# Altium project NB3000XN.PRJPCB (part 2 of 3)

## Sheet FPGA_NonIO.SchDoc: USER FPGA Pwr and Programming
size A4; Organization: Altium Limited.; Address1: Level 3, 12a Rodborough Rd; Address2: Frenchs Forest 2086; Address3: NSW; Address4: AUSTRALIA; DocumentNumber: 8; SheetNumber: 9; SheetTotal: 78
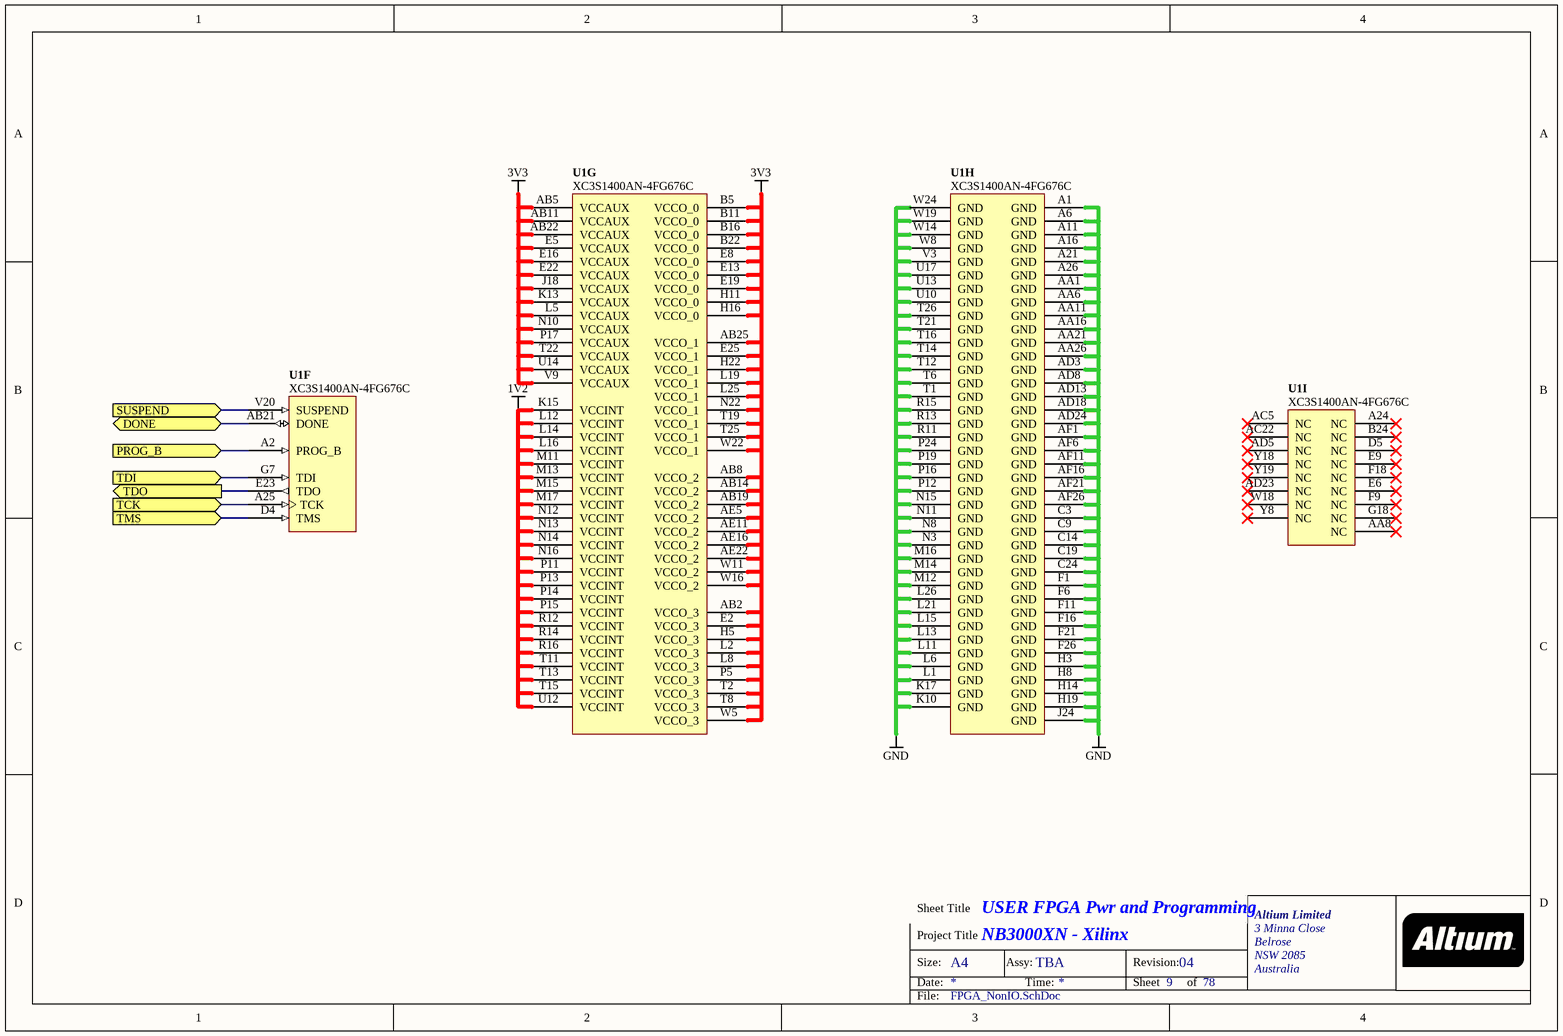
[diagram p4: FPGA_NonIO.SchDoc]

### Parts
(Parts that share a designator on the sheet are numbered #1, #2 ... from top to bottom, then left to right.)
U1#1  XC3S1400AN-4FG676C  [BGA100P26X26-676]  (parts F,G,H,I of 9)

### Ports
DONE (bidir), PROG_B (in), SUSPEND (in), TCK (in), TDI (in), TDO (out), TMS (in)

### Nets
1V2: U1#1.K15(VCCINT) U1#1.L12(VCCINT) U1#1.L14(VCCINT) U1#1.L16(VCCINT) U1#1.M11(VCCINT) U1#1.M13(VCCINT) U1#1.M15(VCCINT) U1#1.M17(VCCINT) U1#1.N12(VCCINT) U1#1.N13(VCCINT) U1#1.N14(VCCINT) U1#1.N16(VCCINT) U1#1.P11(VCCINT) U1#1.P13(VCCINT) U1#1.P14(VCCINT) U1#1.P15(VCCINT) U1#1.R12(VCCINT) U1#1.R14(VCCINT) U1#1.R16(VCCINT) U1#1.T11(VCCINT) U1#1.T13(VCCINT) U1#1.T15(VCCINT) U1#1.U12(VCCINT)
3V3: U1#1.AB2(VCCO_3) U1#1.AB5(VCCAUX) U1#1.AB8(VCCO_2) U1#1.AB11(VCCAUX) U1#1.AB14(VCCO_2) U1#1.AB19(VCCO_2) U1#1.AB22(VCCAUX) U1#1.AB25(VCCO_1) U1#1.AE5(VCCO_2) U1#1.AE11(VCCO_2) U1#1.AE16(VCCO_2) U1#1.AE22(VCCO_2) U1#1.B5(VCCO_0) U1#1.B11(VCCO_0) U1#1.B16(VCCO_0) U1#1.B22(VCCO_0) U1#1.E2(VCCO_3) U1#1.E5(VCCAUX) U1#1.E8(VCCO_0) U1#1.E13(VCCO_0) U1#1.E16(VCCAUX) U1#1.E19(VCCO_0) U1#1.E22(VCCAUX) U1#1.E25(VCCO_1) U1#1.H5(VCCO_3) U1#1.H11(VCCO_0) U1#1.H16(VCCO_0) U1#1.H22(VCCO_1) U1#1.J18(VCCAUX) U1#1.K13(VCCAUX) U1#1.L2(VCCO_3) U1#1.L5(VCCAUX) U1#1.L8(VCCO_3) U1#1.L19(VCCO_1) U1#1.L25(VCCO_1) U1#1.N10(VCCAUX) U1#1.N22(VCCO_1) U1#1.P5(VCCO_3) U1#1.P17(VCCAUX) U1#1.T2(VCCO_3) U1#1.T8(VCCO_3) U1#1.T19(VCCO_1) U1#1.T22(VCCAUX) U1#1.T25(VCCO_1) U1#1.U14(VCCAUX) U1#1.V9(VCCAUX) U1#1.W5(VCCO_3) U1#1.W11(VCCO_2) U1#1.W16(VCCO_2) U1#1.W22(VCCO_1)
GND: U1#1.A1(GND) U1#1.A6(GND) U1#1.A11(GND) U1#1.A16(GND) U1#1.A21(GND) U1#1.A26(GND) U1#1.AA1(GND) U1#1.AA6(GND) U1#1.AA11(GND) U1#1.AA16(GND) U1#1.AA21(GND) U1#1.AA26(GND) U1#1.AD3(GND) U1#1.AD8(GND) U1#1.AD13(GND) U1#1.AD18(GND) U1#1.AD24(GND) U1#1.AF1(GND) U1#1.AF6(GND) U1#1.AF11(GND) U1#1.AF16(GND) U1#1.AF21(GND) U1#1.AF26(GND) U1#1.C3(GND) U1#1.C9(GND) U1#1.C14(GND) U1#1.C19(GND) U1#1.C24(GND) U1#1.F1(GND) U1#1.F6(GND) U1#1.F11(GND) U1#1.F16(GND) U1#1.F21(GND) U1#1.F26(GND) U1#1.H3(GND) U1#1.H8(GND) U1#1.H14(GND) U1#1.H19(GND) U1#1.J24(GND) U1#1.K10(GND) U1#1.K17(GND) U1#1.L1(GND) U1#1.L6(GND) U1#1.L11(GND) U1#1.L13(GND) U1#1.L15(GND) U1#1.L21(GND) U1#1.L26(GND) U1#1.M12(GND) U1#1.M14(GND) U1#1.M16(GND) U1#1.N3(GND) U1#1.N8(GND) U1#1.N11(GND) U1#1.N15(GND) U1#1.P12(GND) U1#1.P16(GND) U1#1.P19(GND) U1#1.P24(GND) U1#1.R11(GND) U1#1.R13(GND) U1#1.R15(GND) U1#1.T1(GND) U1#1.T6(GND) U1#1.T12(GND) U1#1.T14(GND) U1#1.T16(GND) U1#1.T21(GND) U1#1.T26(GND) U1#1.U10(GND) U1#1.U13(GND) U1#1.U17(GND) U1#1.V3(GND) U1#1.V20(SUSPEND) U1#1.W8(GND) U1#1.W14(GND) U1#1.W19(GND) U1#1.W24(GND) ; port SUSPEND
DONE: U1#1.AB21(DONE) ; port DONE
PROG_B: U1#1.A2(PROG_B) ; port PROG_B
TCK: U1#1.A25(TCK) ; port TCK
TDI: U1#1.G7(TDI) ; port TDI
TDO: U1#1.E23(TDO) ; port TDO
TMS: U1#1.D4(TMS) ; port TMS

Not connected (* = marked no-connect by the designer): U1#1 A24(NC)* AA8(NC)* AC5(NC)* AC22(NC)* AD5(NC)* AD23(NC)* B24(NC)* D5(NC)* E6(NC)* E9(NC)* F9(NC)* F18(NC)* G18(NC)* W18(NC)* Y8(NC)* Y18(NC)* Y19(NC)*

### Notes on the sheet
- Sheet Title
- Project Title
- Size:
- Date:
- A4
- Assy:
- Time:
- Revision:
- Sheet
- of
- File:

### Library data of the parts
U1#1 = D-241-0015: FPGA, Xilinx Spartan 3AN-1400 FG676; Supply Voltage: mV; Mounting Technology: Surface Mount; Status: Unreleased; Technology: None; Category: IC-FPGA; NexusDeviceId: XC3S1400AN-4FG676C

## Sheet FPGA_Bypass_1V2.SCHDOC: FPGA Bypass 1V2
size A4; Organization: Altium Limited.; Address1: Level 3, 12a Rodborough Rd; Address2: Frenchs Forest 2086; Address3: NSW; Address4: AUSTRALIA; DocumentNumber: 60; SheetNumber: 61; SheetTotal: 78; PageSetup: Record=PageOptions|CenterHorizontal=True|CenterVertical=True|PrintScale=0.97|XCorrection=1.00|YCorrection=1.00|PrintKind=0|BorderSize=5000000|LeftOffset=0|BottomOffset=0|Orientation=2|PaperLength=1000|PaperWidth=1000|Scale=100|PaperSource=7|PrintQuality=-4|MediaType=1|DitherType=10|PaperKind=A4 (210 x 297 mm)|PrintScaleMode=1
Used 2 times, as channels FPGA_USER/USER_DECOUPLING_CAPS_1V2, FPGA_HOST/HOST_DECOUPLING_CAPS_1V2. Parts and nets are listed once, with the designators drawn on the sheet.
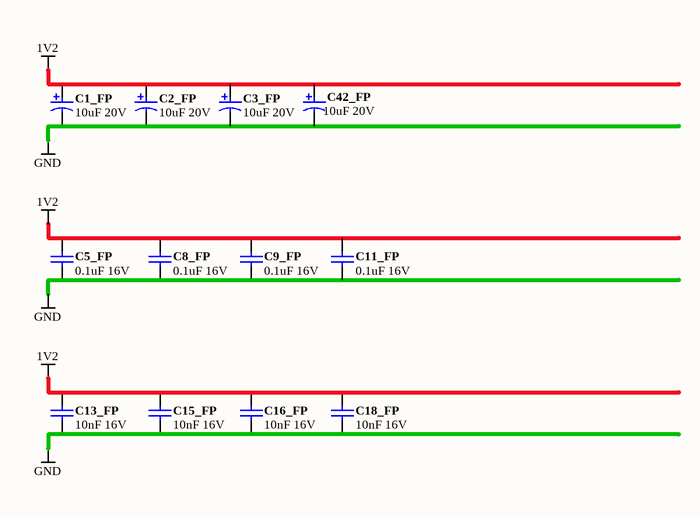
[diagram p5: FPGA_Bypass_1V2.SCHDOC]

### Parts
C1_FP  10uF 20V  [CAPC3528-STAR]
C2_FP  10uF 20V  [CAPC3528-STAR]
C3_FP  10uF 20V  [CAPC3528-STAR]
C5_FP  0.1uF 16V  [CAPC1005-STAR]
C8_FP  0.1uF 16V  [CAPC1005-STAR]
C9_FP  0.1uF 16V  [CAPC1005-STAR]
C11_FP  0.1uF 16V  [CAPC1005-STAR]
C13_FP  10nF 16V  [CAPC1005-STAR]
C15_FP  10nF 16V  [CAPC1005-STAR]
C16_FP  10nF 16V  [CAPC1005-STAR]
C18_FP  10nF 16V  [CAPC1005-STAR]
C42_FP  10uF 20V  [CAPC3528-STAR]

### Nets
1V2: C1_FP.1 C2_FP.1 C3_FP.1 C5_FP.1 C8_FP.1 C9_FP.1 C11_FP.1 C13_FP.1 C15_FP.1 C16_FP.1 C18_FP.1 C42_FP.1
GND: C1_FP.2 C2_FP.2 C3_FP.2 C5_FP.2 C8_FP.2 C9_FP.2 C11_FP.2 C13_FP.2 C15_FP.2 C16_FP.2 C18_FP.2 C42_FP.2

### Channels
FPGA_USER/USER_DECOUPLING_CAPS_1V2: designators end in A
FPGA_HOST/HOST_DECOUPLING_CAPS_1V2: designators end in B

### Notes on the sheet
- Sheet Title
- Project Title
- Size:
- Date:
- A4
- Assy:
- Time:
- Revision:
- Sheet
- of
- File:

### Library data of the parts
C1_FP C2_FP C3_FP C42_FP = D-101-0007: Capacitor, Tantalum, 10uF 10% 20V MCCT-B (3528); Polarity: Polarized; Category: Capacitor; Capacitance: 10 uF; Mounting Technology: Surface Mount; Rated Voltage: 20 V; Status: Production; Technology: Tantalum; Tolerance: 10 %
C5_FP C8_FP C9_FP C11_FP = D-101-0080: Capacitor, Ceramic, 0.1uF 10% 16V 0402 (1005) X7R; Polarity: Non-Polarized; Category: Capacitor; Capacitance: 0.1 uF; Dielectric: X7R; Mounting Technology: Surface Mount; Rated Voltage: 16 V; Status: Production; Technology: Ceramic; Tolerance: 10 %
C13_FP C15_FP C16_FP C18_FP = D-101-0077: Capacitor, Ceramic, 10nF 10% 16V 0402 (1005) X7R; Polarity: Non-Polarized; Category: Capacitor; Capacitance: 10 nF; Dielectric: X7R; Mounting Technology: Surface Mount; Rated Voltage: 16 V; Status: Production; Technology: Ceramic; Tolerance: 10 %

## Sheet FPGA_Bypass_3V3.SCHDOC: FPGA Bypass 3V3
size A4; Organization: Altium Limited.; Address1: Level 3, 12a Rodborough Rd; Address2: Frenchs Forest 2086; Address3: NSW; Address4: AUSTRALIA; DocumentNumber: 58; SheetNumber: 59; SheetTotal: 78; PageSetup: Record=PageOptions|CenterHorizontal=True|CenterVertical=True|PrintScale=0.97|XCorrection=1.00|YCorrection=1.00|PrintKind=0|BorderSize=5000000|LeftOffset=0|BottomOffset=0|Orientation=2|PaperLength=1000|PaperWidth=1000|Scale=100|PaperSource=7|PrintQuality=-4|MediaType=1|DitherType=10|PaperKind=A4 (210 x 297 mm)|PrintScaleMode=1
Used 2 times, as channels FPGA_USER/USER_DECOUPLING_CAPS_3V3, FPGA_HOST/HOST_DECOUPLING_CAPS_3V3. Parts and nets are listed once, with the designators drawn on the sheet.
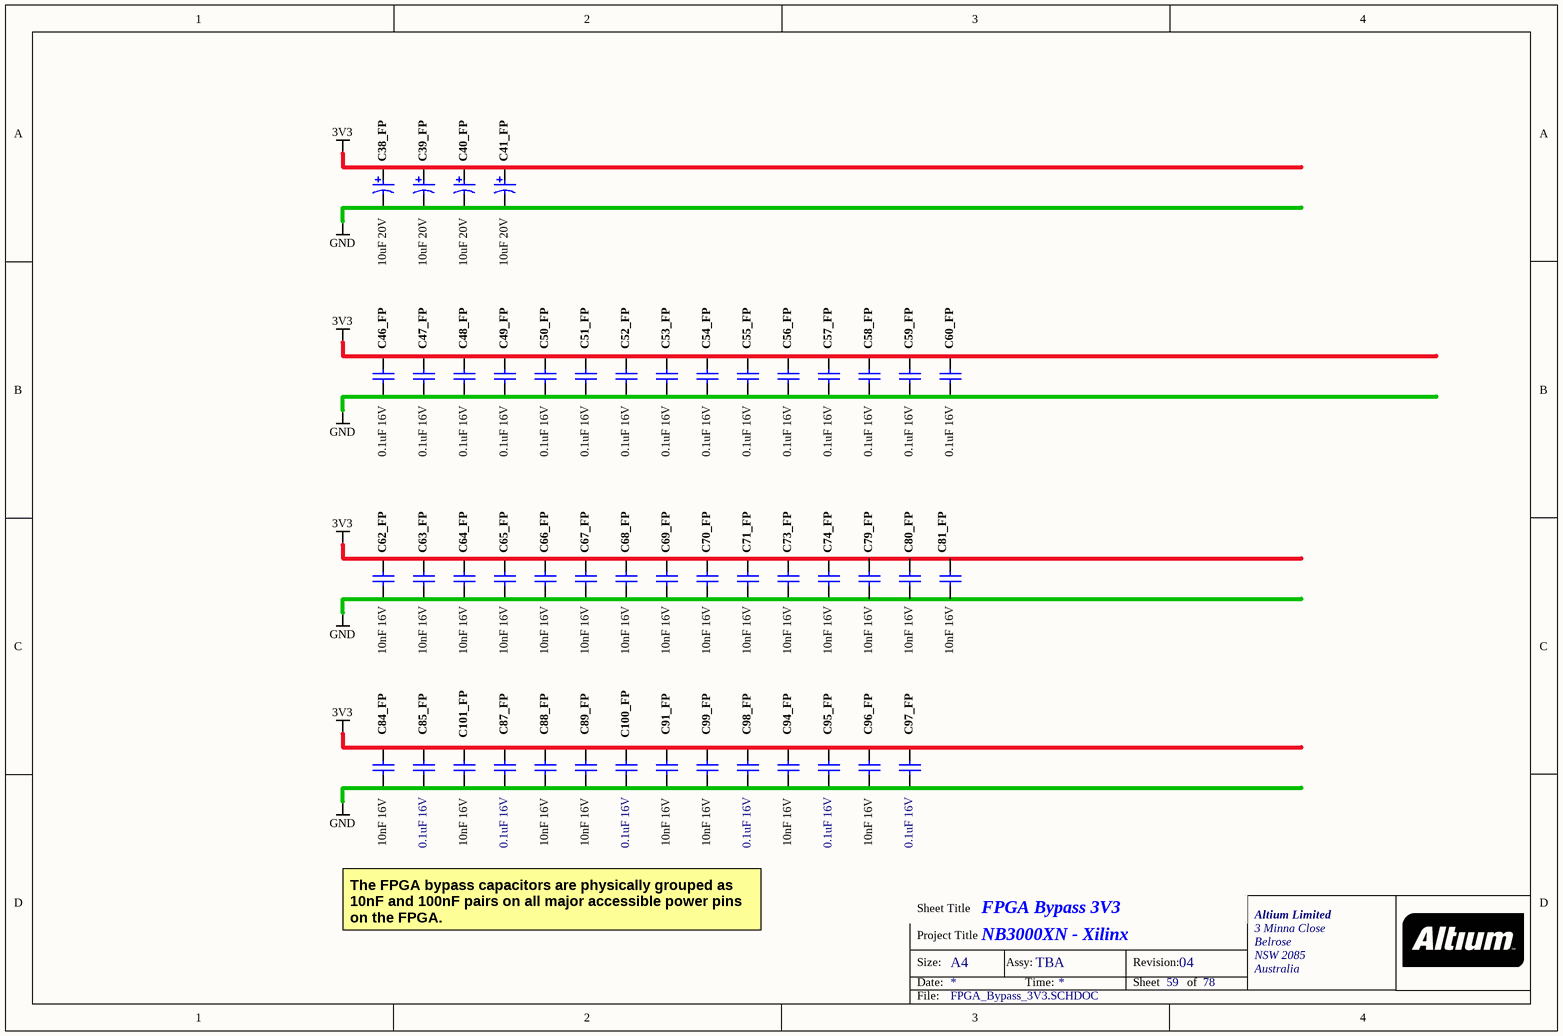
[diagram p6: FPGA_Bypass_3V3.SCHDOC]

### Parts
C38_FP  10uF 20V  [CAPC3528-STAR]
C39_FP  10uF 20V  [CAPC3528-STAR]
C40_FP  10uF 20V  [CAPC3528-STAR]
C41_FP  10uF 20V  [CAPC3528-STAR]
C46_FP  0.1uF 16V  [CAPC1005-STAR]
C47_FP  0.1uF 16V  [CAPC1005-STAR]
C48_FP  0.1uF 16V  [CAPC1005-STAR]
C49_FP  0.1uF 16V  [CAPC1005-STAR]
C50_FP  0.1uF 16V  [CAPC1005-STAR]
C51_FP  0.1uF 16V  [CAPC1005-STAR]
C52_FP  0.1uF 16V  [CAPC1005-STAR]
C53_FP  0.1uF 16V  [CAPC1005-STAR]
C54_FP  0.1uF 16V  [CAPC1005-STAR]
C55_FP  0.1uF 16V  [CAPC1005-STAR]
C56_FP  0.1uF 16V  [CAPC1005-STAR]
C57_FP  0.1uF 16V  [CAPC1005-STAR]
C58_FP  0.1uF 16V  [CAPC1005-STAR]
C59_FP  0.1uF 16V  [CAPC1005-STAR]
C60_FP  0.1uF 16V  [CAPC1005-STAR]
C62_FP  10nF 16V  [CAPC1005-STAR]
C63_FP  10nF 16V  [CAPC1005-STAR]
C64_FP  10nF 16V  [CAPC1005-STAR]
C65_FP  10nF 16V  [CAPC1005-STAR]
C66_FP  10nF 16V  [CAPC1005-STAR]
C67_FP  10nF 16V  [CAPC1005-STAR]
C68_FP  10nF 16V  [CAPC1005-STAR]
C69_FP  10nF 16V  [CAPC1005-STAR]
C70_FP  10nF 16V  [CAPC1005-STAR]
C71_FP  10nF 16V  [CAPC1005-STAR]
C73_FP  10nF 16V  [CAPC1005-STAR]
C74_FP  10nF 16V  [CAPC1005-STAR]
C79_FP  10nF 16V  [CAPC1005-STAR]
C80_FP  10nF 16V  [CAPC1005-STAR]
C81_FP  10nF 16V  [CAPC1005-STAR]
C84_FP  10nF 16V  [CAPC1005-STAR]
C85_FP  0.1uF 16V  [CAPC1005-STAR]
C87_FP  0.1uF 16V  [CAPC1005-STAR]
C88_FP  10nF 16V  [CAPC1005-STAR]
C89_FP  10nF 16V  [CAPC1005-STAR]
C91_FP  10nF 16V  [CAPC1005-STAR]
C94_FP  10nF 16V  [CAPC1005-STAR]
C95_FP  0.1uF 16V  [CAPC1005-STAR]
C96_FP  10nF 16V  [CAPC1005-STAR]
C97_FP  0.1uF 16V  [CAPC1005-STAR]
C98_FP  0.1uF 16V  [CAPC1005-STAR]
C99_FP  10nF 16V  [CAPC1005-STAR]
C100_FP  0.1uF 16V  [CAPC1005-STAR]
C101_FP  10nF 16V  [CAPC1005-STAR]

### Nets
3V3: C38_FP.1 C39_FP.1 C40_FP.1 C41_FP.1 C46_FP.1 C47_FP.1 C48_FP.1 C49_FP.1 C50_FP.1 C51_FP.1 C52_FP.1 C53_FP.1 C54_FP.1 C55_FP.1 C56_FP.1 C57_FP.1 C58_FP.1 C59_FP.1 C60_FP.1 C62_FP.1 C63_FP.1 C64_FP.1 C65_FP.1 C66_FP.1 C67_FP.1 C68_FP.1 C69_FP.1 C70_FP.1 C71_FP.1 C73_FP.1 C74_FP.1 C79_FP.1 C80_FP.1 C81_FP.1 C84_FP.1 C85_FP.1 C87_FP.1 C88_FP.1 C89_FP.1 C91_FP.1 C94_FP.1 C95_FP.1 C96_FP.1 C97_FP.1 C98_FP.1 C99_FP.1 C100_FP.1 C101_FP.1
GND: C38_FP.2 C39_FP.2 C40_FP.2 C41_FP.2 C46_FP.2 C47_FP.2 C48_FP.2 C49_FP.2 C50_FP.2 C51_FP.2 C52_FP.2 C53_FP.2 C54_FP.2 C55_FP.2 C56_FP.2 C57_FP.2 C58_FP.2 C59_FP.2 C60_FP.2 C62_FP.2 C63_FP.2 C64_FP.2 C65_FP.2 C66_FP.2 C67_FP.2 C68_FP.2 C69_FP.2 C70_FP.2 C71_FP.2 C73_FP.2 C74_FP.2 C79_FP.2 C80_FP.2 C81_FP.2 C84_FP.2 C85_FP.2 C87_FP.2 C88_FP.2 C89_FP.2 C91_FP.2 C94_FP.2 C95_FP.2 C96_FP.2 C97_FP.2 C98_FP.2 C99_FP.2 C100_FP.2 C101_FP.2

### Channels
FPGA_USER/USER_DECOUPLING_CAPS_3V3: designators end in A
FPGA_HOST/HOST_DECOUPLING_CAPS_3V3: designators end in B

### Notes on the sheet
- The FPGA bypass capacitors are physically grouped as 10nF and 100nF pairs on all major accessible power pins on the FPGA.
- Sheet Title
- Project Title
- Size:
- Date:
- A4
- Assy:
- Time:
- Revision:
- Sheet
- of
- File:

### Library data of the parts
C38_FP C39_FP C40_FP C41_FP = D-101-0007: as C1_FP on sheet FPGA_Bypass_1V2; Category: Capacitor; Capacitance: 10 uF; Mounting Technology: Surface Mount; Rated Voltage: 20 V; Status: Production; Technology: Tantalum; Tolerance: 10 %
C46_FP C47_FP C48_FP C49_FP C50_FP C51_FP C52_FP C53_FP C54_FP C55_FP C56_FP C57_FP C58_FP C59_FP C60_FP C85_FP C87_FP C95_FP C97_FP C98_FP C100_FP = D-101-0080: as C5_FP on sheet FPGA_Bypass_1V2; Category: Capacitor; Dielectric: X7R; Mounting Technology: Surface Mount; Status: Production; Technology: Ceramic
  C46_FP C47_FP C48_FP C49_FP C50_FP C51_FP C52_FP C53_FP C54_FP C55_FP C56_FP C57_FP C58_FP C59_FP C60_FP: Capacitance: 0.1 uF; Rated Voltage: 16 V; Tolerance: 10 %
  C85_FP C87_FP C95_FP C97_FP C98_FP C100_FP: Capacitance: 0.1uF; Rated Voltage: 16V; Tolerance: 10%
C62_FP C63_FP C64_FP C65_FP C66_FP C67_FP C68_FP C69_FP C70_FP C71_FP C73_FP C74_FP C79_FP C80_FP C81_FP C84_FP C88_FP C89_FP C91_FP C94_FP C96_FP C99_FP C101_FP = D-101-0077: as C13_FP on sheet FPGA_Bypass_1V2; Category: Capacitor; Capacitance: 10 nF; Dielectric: X7R; Mounting Technology: Surface Mount; Rated Voltage: 16 V; Status: Production; Technology: Ceramic; Tolerance: 10 %

## Sheet VGA_OUT.SCHDOC: VGA Ouput
size A4; DocumentNumber: 2; SheetNumber: 3; SheetTotal: 78; PageSetup: Record=PageOptions|CenterHorizontal=True|CenterVertical=True|PrintScale=0.97|XCorrection=1.00|YCorrection=1.00|PrintKind=1|BorderSize=5000000|LeftOffset=0|BottomOffset=0|Orientation=2|PaperLength=1000|PaperWidth=1000|Scale=100|PaperSource=7|PrintQuality=-4|MediaType=1|DitherType=10|PaperKind=A4 (210 x 297 mm)|PrintScaleMode=1
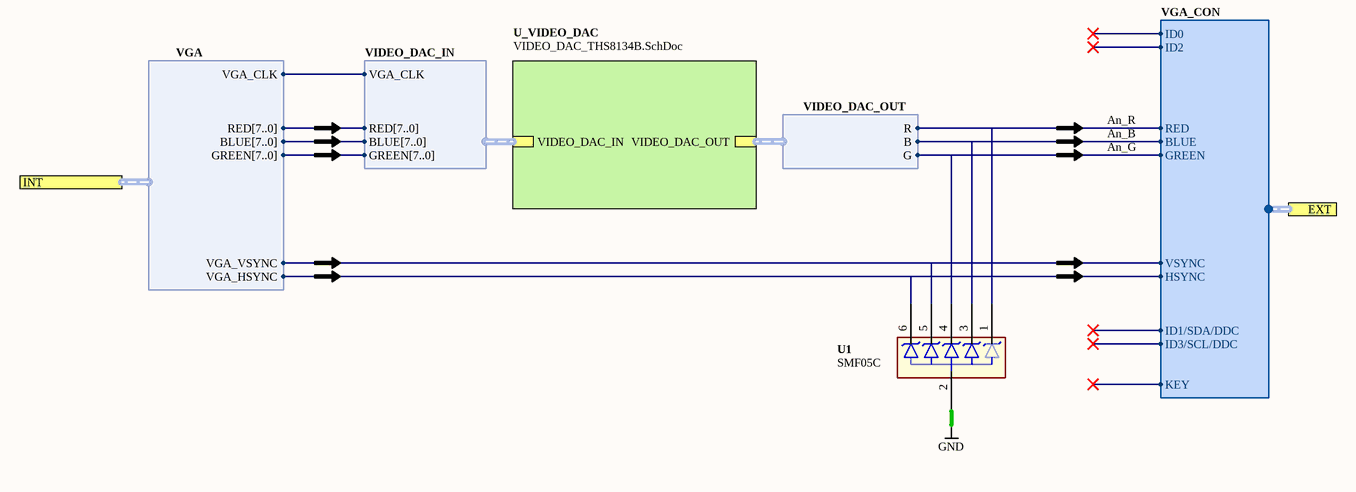
[diagram p7: VGA_OUT.SCHDOC]

### Parts
(Parts that share a designator on the sheet are numbered #1, #2 ... from top to bottom, then left to right.)
U1#2  SMF05C  [SC70_6L]

### Sub-sheets
U_VIDEO_DAC = VIDEO_DAC_THS8134B.SchDoc: VIDEO_DAC_OUT (harness VIDEO_DAC_OUT), VIDEO_DAC_IN (harness VIDEO_DAC_IN)

### Ports
EXT (harness VGA_CON), INT (harness VGA)

### Harnesses
VIDEO_DAC_IN: RED[7..0], GREEN[7..0], BLUE[7..0], VGA_CLK
VIDEO_DAC_OUT: B, R, G
VGA: RED[7..0], GREEN[7..0], BLUE[7..0], VGA_CLK, VGA_VSYNC, VGA_HSYNC
VGA_CON: RED, GREEN, BLUE, VSYNC, HSYNC, KEY, ID2, ID3/SCL/DDC, ID1/SDA/DDC, ID0

### Nets
GND: U1#2.2
An_B: U1#2.3 ; sheet U_VIDEO_DAC/VIDEO_DAC_OUT.B, port EXT.BLUE  [project net VGA#.BLUE]
An_G: U1#2.4 ; sheet U_VIDEO_DAC/VIDEO_DAC_OUT.G, port EXT.GREEN  [project net VGA#.GREEN]
An_R: U1#2.1 ; sheet U_VIDEO_DAC/VIDEO_DAC_OUT.R, port EXT.RED  [project net VGA#.RED]
VGA#.HSYNC: U1#2.6 ; port INT.VGA_HSYNC, port EXT.HSYNC
VGA#.VSYNC: U1#2.5 ; port INT.VGA_VSYNC, port EXT.VSYNC
VGA.VGA_CLK: sheet U_VIDEO_DAC/VIDEO_DAC_IN.VGA_CLK, port INT.VGA_CLK

### Notes on the sheet
- Sheet Title
- Project Title
- Size:
- Date:
- A4
- Assy:
- Time:
- Revision:
- Sheet
- of
- File:

### Library data of the parts
U1#2 = D-157-0000: TVS Diode Array  For ESD and Latch-Up Protection; Junction Capacitance: 130 pF; Peak Pulse Current: 8 A; Peak Pulse Power: 100 W; Reverse Breakdown Voltage: 6 V; Status: Unreleased; Category: Diode-Protection

## Sheet VIDEO_DAC_THS8134B.SchDoc: Video DAC
size A4; Organization: Altium Limited.; Address1: Level 3, 12a Rodborough Rd; Address2: Frenchs Forest 2086; Address3: NSW; Address4: AUSTRALIA; DocumentNumber: 62; SheetNumber: 63; SheetTotal: 78
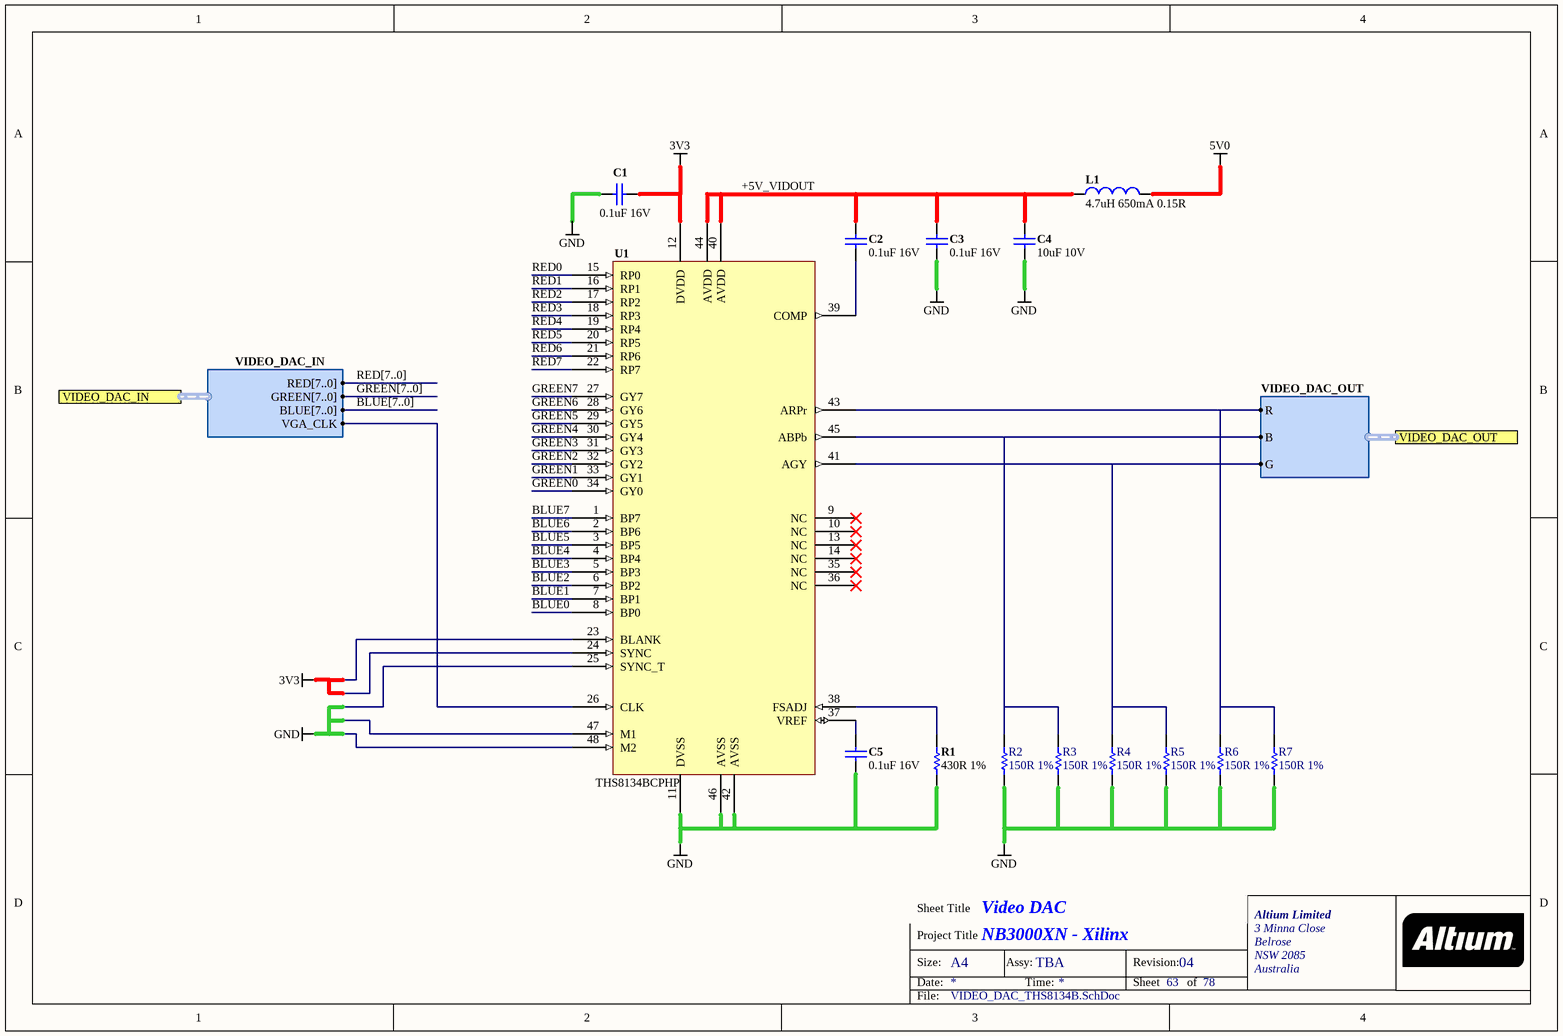
[diagram p8: VIDEO_DAC_THS8134B.SchDoc]

### Parts
(Parts that share a designator on the sheet are numbered #1, #2 ... from top to bottom, then left to right.)
C1#2  0.1uF 16V  [CAPC1005-STAR]
C2#2  0.1uF 16V  [CAPC1005-STAR]
C3#2  0.1uF 16V  [CAPC1005-STAR]
C4#2  10uF 10V  [CAPC2012-STAR]
C5#1  0.1uF 16V  [CAPC1005-STAR]
L1#1  4.7uH 650mA 0.15R  [INDC3225]
R1#2  430R 1%  [RESC1005-STAR]
R2#2  150R 1%  [RESC1005-STAR]
R3#2  150R 1%  [RESC1005-STAR]
R4#2  150R 1%  [RESC1005-STAR]
R5#1  150R 1%  [RESC1005-STAR]
R6#1  150R 1%  [RESC1005-STAR]
R7#1  150R 1%  [RESC1005-STAR]
U1#3  THS8134BCPHP  [TSQFP50P900X900_HS-48]

### Ports
VIDEO_DAC_IN (harness VIDEO_DAC_IN), VIDEO_DAC_OUT (harness VIDEO_DAC_OUT)

### Harnesses
VIDEO_DAC_OUT: B, R, G
VIDEO_DAC_IN: RED[7..0], GREEN[7..0], BLUE[7..0], VGA_CLK

### Nets
3V3: C1#2.1 U1#3.12(DVDD) U1#3.23(BLANK) U1#3.24(SYNC)
5V0: L1#1.1
GND: C1#2.2 C3#2.2 C4#2.1 C5#1.2 R1#2.1 R2#2.2 R3#2.1 R4#2.2 R5#1.1 R6#1.1 R7#1.1 U1#3.11(DVSS) U1#3.25(SYNC_T) U1#3.42(AVSS) U1#3.46(AVSS) U1#3.47(M1) U1#3.48(M2)
+5V_VIDOUT: C2#2.1 C3#2.1 C4#2.2 L1#1.2 U1#3.40(AVDD) U1#3.44(AVDD)
BLUE0: U1#3.8(BP0)  [project net VGA_BLUE0]
BLUE1: U1#3.7(BP1)  [project net VGA_BLUE1]
BLUE2: U1#3.6(BP2)  [project net VGA_BLUE2]
BLUE3: U1#3.5(BP3)  [project net VGA_BLUE3]
BLUE4: U1#3.4(BP4)  [project net VGA_BLUE4]
BLUE5: U1#3.3(BP5)  [project net VGA_BLUE5]
BLUE6: U1#3.2(BP6)  [project net VGA_BLUE6]
BLUE7: U1#3.1(BP7)  [project net VGA_BLUE7]
GREEN0: U1#3.34(GY0)  [project net VGA_GREEN0]
GREEN1: U1#3.33(GY1)  [project net VGA_GREEN1]
GREEN2: U1#3.32(GY2)  [project net VGA_GREEN2]
GREEN3: U1#3.31(GY3)  [project net VGA_GREEN3]
GREEN4: U1#3.30(GY4)  [project net VGA_GREEN4]
GREEN5: U1#3.29(GY5)  [project net VGA_GREEN5]
GREEN6: U1#3.28(GY6)  [project net VGA_GREEN6]
GREEN7: U1#3.27(GY7)  [project net VGA_GREEN7]
RED0: U1#3.15(RP0)  [project net VGA_RED0]
RED1: U1#3.16(RP1)  [project net VGA_RED1]
RED2: U1#3.17(RP2)  [project net VGA_RED2]
RED3: U1#3.18(RP3)  [project net VGA_RED3]
RED4: U1#3.19(RP4)  [project net VGA_RED4]
RED5: U1#3.20(RP5)  [project net VGA_RED5]
RED6: U1#3.21(RP6)  [project net VGA_RED6]
RED7: U1#3.22(RP7)  [project net VGA_RED7]
VGA#.BLUE: R2#2.1 R3#2.2 U1#3.45(ABPb) ; port VIDEO_DAC_OUT.B
VGA#.GREEN: R4#2.1 R5#1.2 U1#3.41(AGY) ; port VIDEO_DAC_OUT.G
VGA#.RED: R6#1.2 R7#1.2 U1#3.43(ARPr) ; port VIDEO_DAC_OUT.R
VGA.VGA_CLK: U1#3.26(CLK) ; port VIDEO_DAC_IN.VGA_CLK
NetC2#2_2: C2#2.2 U1#3.39(COMP)
NetC5#1_1: C5#1.1 U1#3.37(VREF)
NetR1#2_2: R1#2.2 U1#3.38(FSADJ)

Not connected (* = marked no-connect by the designer): U1#3 9(NC)* 10(NC)* 13(NC)* 14(NC)* 35(NC)* 36(NC)*

### Buses and harness runs
bus BLUE[7..0]
bus GREEN[7..0]
bus RED[7..0]

### Notes on the sheet
- Sheet Title
- Project Title
- Size:
- Date:
- A4
- Assy:
- Time:
- Revision:
- Sheet
- of
- File:

### Library data of the parts
C1#2 C2#2 C3#2 C5#1 = D-101-0080: as C5_FP on sheet FPGA_Bypass_1V2; Capacitance: 0.1 uF; Category: Capacitor; Dielectric: X7R; Mounting Technology: Surface Mount; Rated Voltage: 16 V; Status: Production; Technology: Ceramic; Tolerance: 10 %
C4#2 = D-101-0087: Capacitor, Ceramic, 10uF 10% 10V 0805 (2012) X5R; Polarity: Non-Polarized; Capacitance: 10 uF; Category: Capacitor; Dielectric: X5R; Mounting Technology: Surface Mount; Rated Voltage: 10 V; Status: Unreleased; Technology: None; Tolerance: 10 %
L1#1 = D-102-0005: Inductor, 4.7uH 650mA 0.15R 1210 (3225) LQH32CN4R7M11L; Category: Inductor; Status: Production
R1#2 = D-100-0096: Resistor, 430R 1% 0402 (1005); Power Rating: 63 mW; Category: Resistor; Mounting Technology: Surface Mount; Resistance: 430 R; Status: Production; Tolerance: 1 %
R2#2 R3#2 R4#2 R5#1 R6#1 R7#1 = D-100-0005: Resistor, 150R 1% 0402 (1005); Power Rating: 63mW; Category: Resistor; Mounting Technology: Surface Mount; Resistance: 150R; Status: Unreleased; Tolerance: 1%
U1#3 = D-222-0000: THS8134BCPHP, Triple 8-Bit, 80 MSPS Video DAC with Tri-Level Sync Generation; Status: Production; Category: IC-DAC

## Sheet Host_FPGA.SchDoc: Host Controller - Spartan3AN-400
size A2; Organization: Altium Limited.; Address1: Level 3, 12a Rodborough Rd; Address2: Frenchs Forest 2086; Address3: NSW; Address4: AUSTRALIA; DocumentNumber: 28; Revision: 6; SheetNumber: 29; SheetTotal: 78; PageSetup: Record=PageOptions|CenterHorizontal=True|CenterVertical=True|PrintScale=0.47|XCorrection=1.00|YCorrection=1.00|PrintKind=0|BorderSize=5000000|LeftOffset=0|BottomOffset=0|Orientation=2|PaperLength=1000|PaperWidth=1000|Scale=100|PaperSource=7|PrintQuality=1200|MediaType=1|DitherType=10|PaperKind=A4 (210 x 297 mm)|PrintScaleMode=1
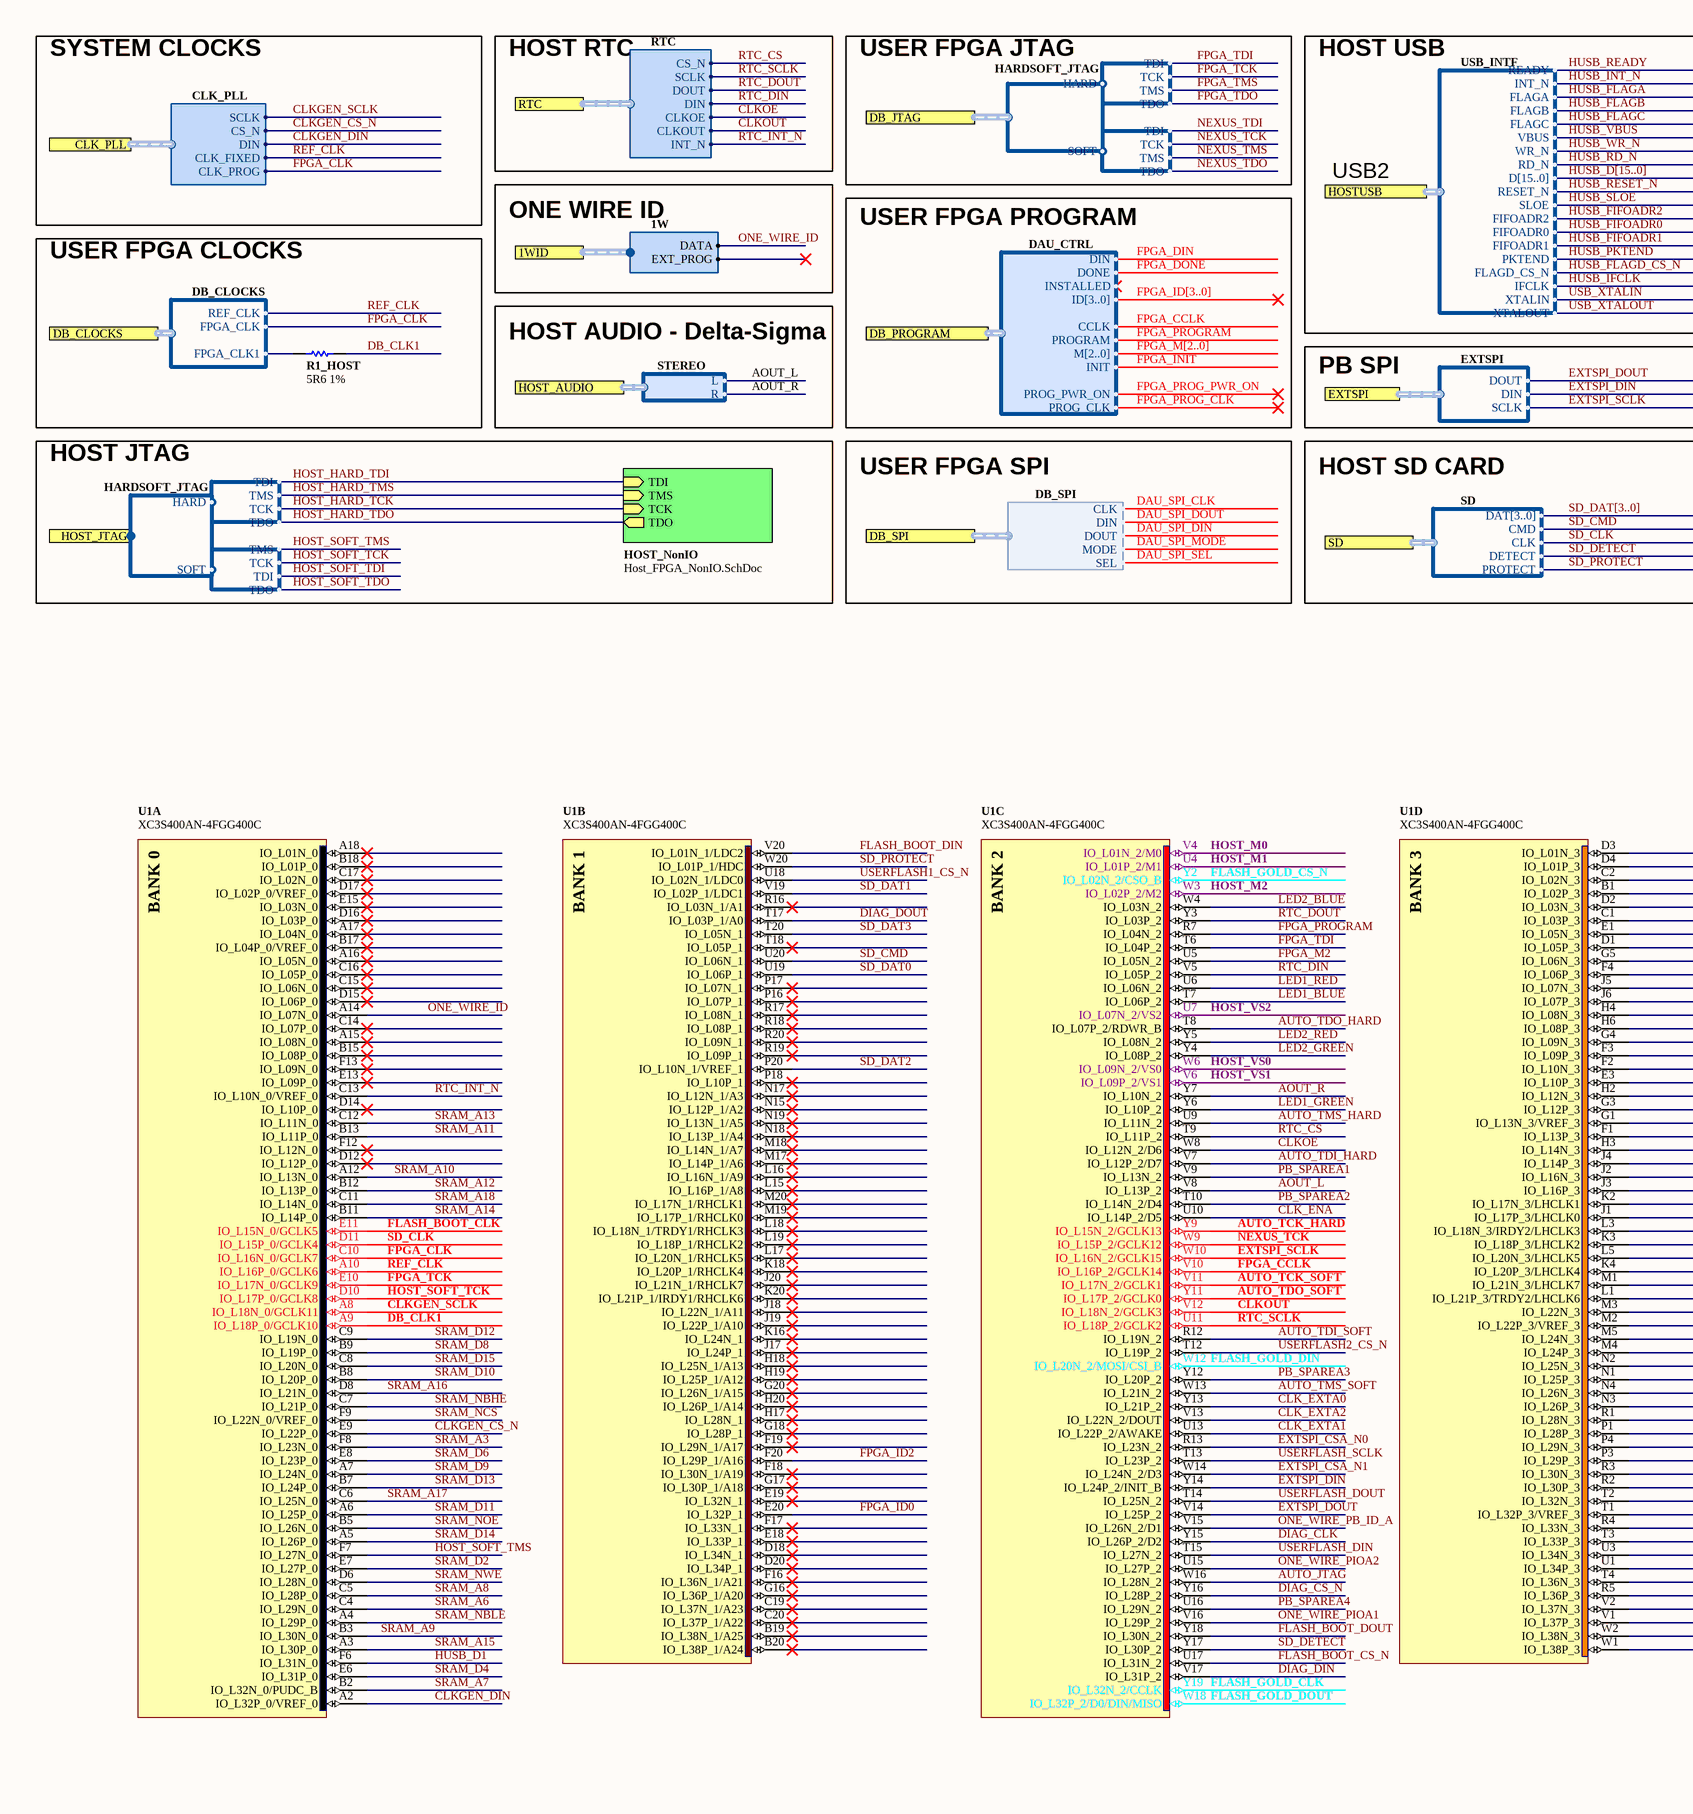
[diagram p9: Host_FPGA.SchDoc, left]
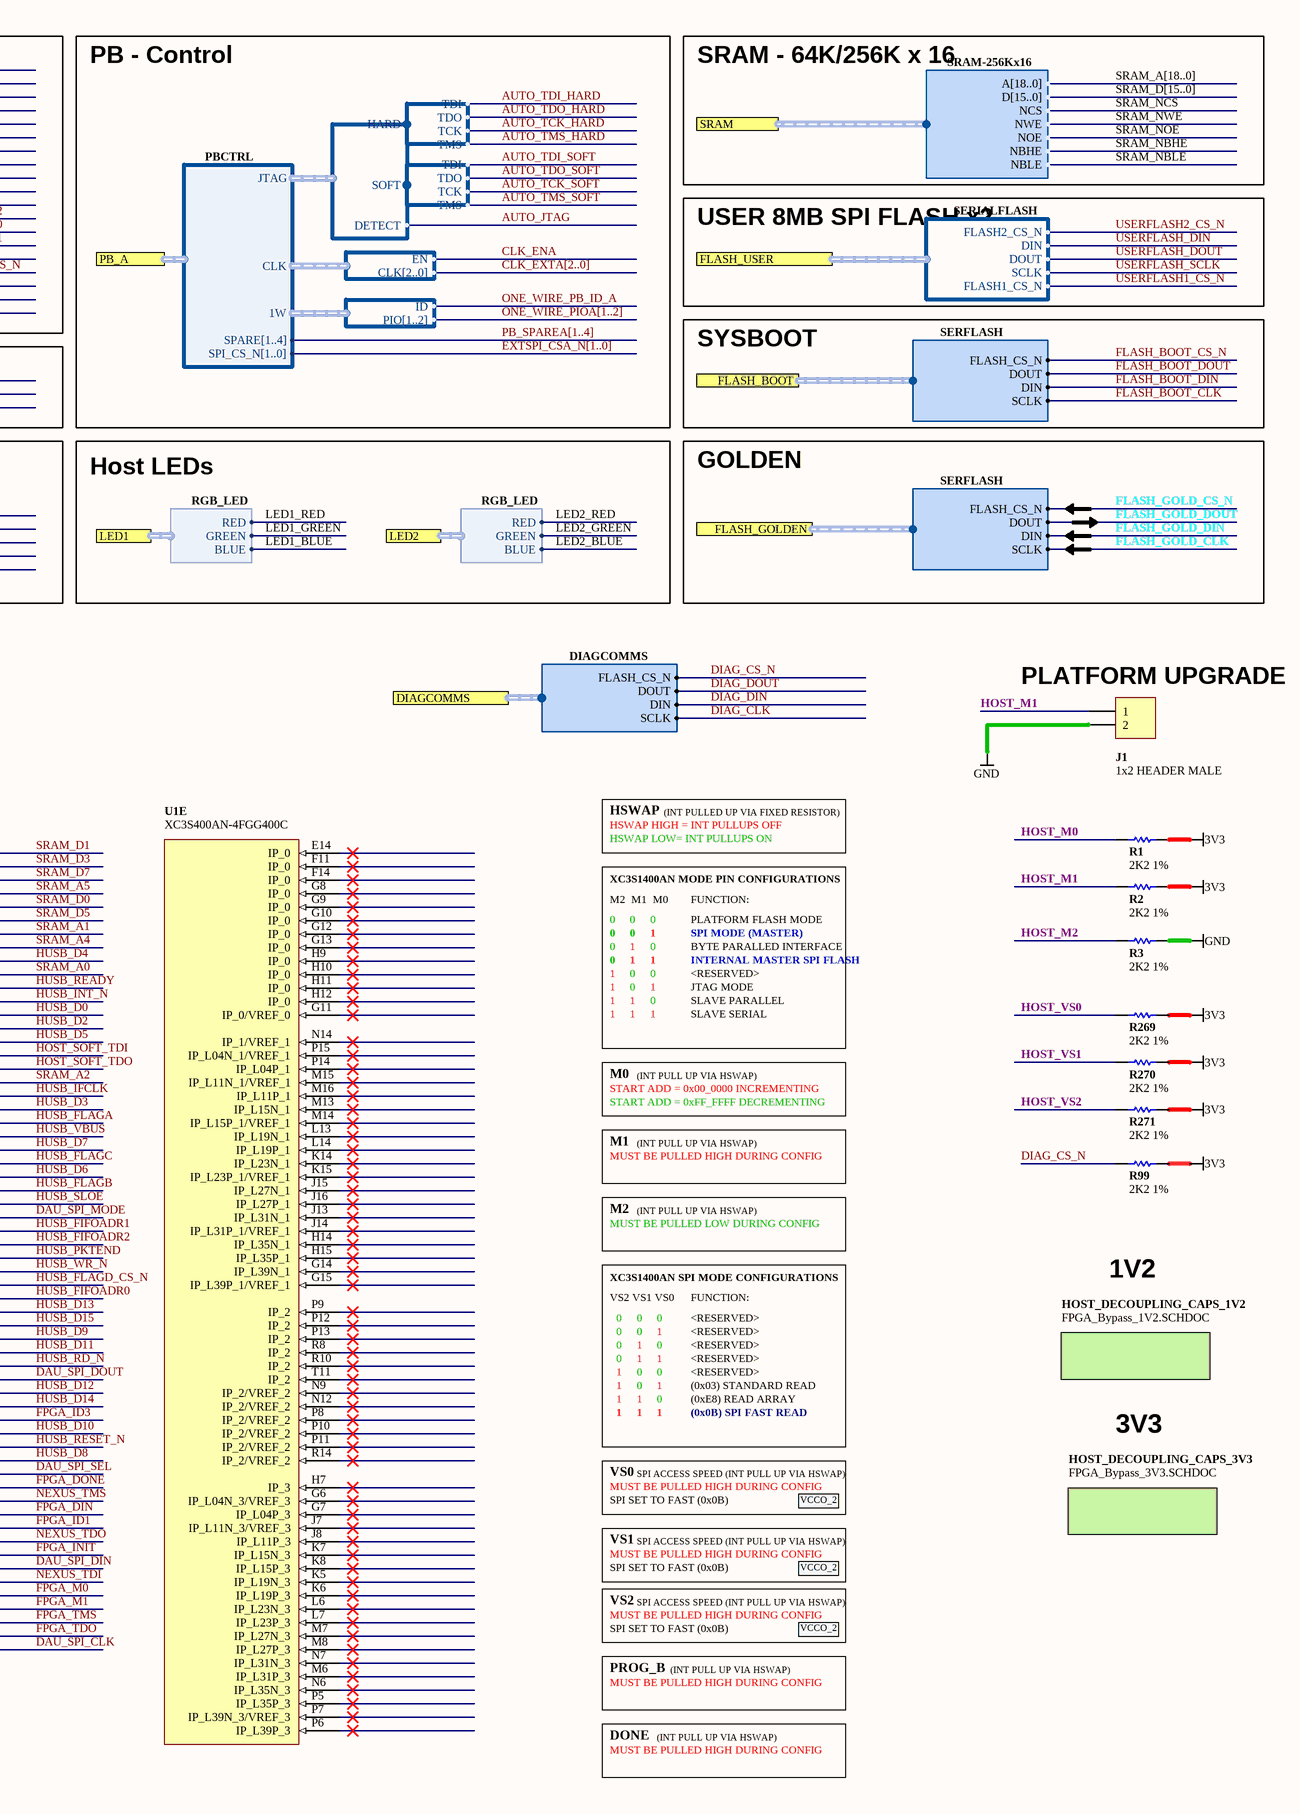
[diagram p10: Host_FPGA.SchDoc, right]

### Parts
(Parts that share a designator on the sheet are numbered #1, #2 ... from top to bottom, then left to right.)
J1#2  1x2 HEADER MALE  [HDR1X2]
R1#3  2K2 1%  [RESC1005-STAR]
R1_HOST  5R6 1%  [RESC1005-STAR]
R2#3  2K2 1%  [RESC1005-STAR]
R3#3  2K2 1%  [RESC1005-STAR]
R99  2K2 1%  [RESC1005-STAR]
R269  2K2 1%  [RESC1005-STAR]
R270  2K2 1%  [RESC1005-STAR]
R271  2K2 1%  [RESC1005-STAR]
U1#4  XC3S400AN-4FGG400C  [FGG400]  (parts A,B,C,D,E of 8)

### Blocks framed on the sheet
USER FPGA CLOCKS: R1_HOST

### Sub-sheets
HOST_DECOUPLING_CAPS_1V2 = FPGA_Bypass_1V2.SCHDOC: no entries
HOST_DECOUPLING_CAPS_3V3 = FPGA_Bypass_3V3.SCHDOC: no entries
HOST_NonIO = Host_FPGA_NonIO.SchDoc: TMS (in), TCK (in), TDI (in), TDO (out)

### Ports
1WID (harness 1W), CLK_PLL (harness CLK_PLL), DB_CLOCKS (harness DB_CLOCKS), DB_JTAG (harness HARDSOFT_JTAG), DB_PROGRAM (harness DAU_CTRL), DB_SPI (harness DB_SPI), DIAGCOMMS (harness DIAGCOMMS), EXTSPI (harness EXTSPI), FLASH_BOOT (harness SERFLASH), FLASH_GOLDEN (harness SERFLASH), FLASH_USER (harness SERIALFLASH), HOST_AUDIO (harness STEREO), HOST_JTAG (harness HARDSOFT_JTAG), HOSTUSB (harness USB_INTF), LED1 (harness RGB_LED), LED2 (harness RGB_LED), PB_A (harness PBCTRL), RTC (harness RTC), SD (harness SD), SRAM (harness SRAM-256Kx16)

### Harnesses
SERIALFLASH: FLASH2_CS_N, DIN, DOUT, SCLK, FLASH1_CS_N
JTAG: TMS, TDO, TDI, TCK
HARDSOFT_JTAG: HARD, SOFT
SD: DAT[3..0], CMD, CLK, DETECT, PROTECT
STEREO: L, R
RTC: CS_N, DIN, DOUT, INT_N, SCLK, CLKOUT, CLKOE
DAU_CTRL: DIN, DONE, INSTALLED, ID[3..0], CCLK, PROGRAM, M[2..0], INIT, PROG_PWR_ON, PROG_CLK
1W: DATA, EXT_PROG
CLK_PLL: CLK_FIXED, CLK_PROG, CS_N, DIN, SCLK
SRAM-256Kx16: A[18..0], D[15..0], NCS, NWE, NOE, NBHE, NBLE
RGB_LED: GREEN, RED, BLUE
DB_CLOCKS: REF_CLK, FPGA_CLK, FPGA_CLK1
DB_SPI: MODE, SEL, CLK, DIN, DOUT
JTAG_CONFIG: HARD, SOFT, DETECT
JTAG: TDI, TDO, TCK, TMS
GATE_CLOCKS: EN, CLK[2..0]
ONE_WIRE: ID, PIO[1..2]
PBCTRL: JTAG, CLK, 1W, SPI_CS_N[1..0], SPARE[1..4]
EXTSPI: DOUT, DIN, SCLK
SERFLASH: DIN, DOUT, SCLK, FLASH_CS_N
USB_INTF: READY, INT_N, SLOE, FIFOADR2, FIFOADR0, FIFOADR1, PKTEND, FLAGD_CS_N, FLAGA, FLAGB, FLAGC, WR_N, RD_N, D[15..0], RESET_N, IFCLK, XTALIN, VBUS, XTALOUT
DIAGCOMMS: DIN, DOUT, SCLK, FLASH_CS_N

### Nets
3V3: R1#3.2 R2#3.2 R99.2 R269.2 R270.2 R271.2
GND: J1#2.2 R3#3.2
AOUT_L: U1#4.V8(IO_L13P_2) ; port HOST_AUDIO.L  [project net HOST_AUDIO.L]
AOUT_R: U1#4.Y7(IO_L10N_2) ; port HOST_AUDIO.R  [project net HOST_AUDIO.R]
AUTO_JTAG: U1#4.W16(IO_L28N_2) ; harness JTAG_CONFIG.DETECT
AUTO_TCK_HARD: U1#4.Y9(IO_L15N_2/GCLK13) ; harness JTAG.TCK
AUTO_TCK_SOFT: U1#4.V11(IO_L17N_2/GCLK1) ; harness JTAG.TCK
AUTO_TDI_HARD: U1#4.V7(IO_L12P_2/D7) ; harness JTAG.TDI
AUTO_TDI_SOFT: U1#4.R12(IO_L19N_2) ; harness JTAG.TDI
AUTO_TDO_HARD: U1#4.T8(IO_L07P_2/RDWR_B) ; harness JTAG.TDO
AUTO_TDO_SOFT: U1#4.Y11(IO_L17P_2/GCLK0) ; harness JTAG.TDO
AUTO_TMS_HARD: U1#4.U9(IO_L11N_2) ; harness JTAG.TMS
AUTO_TMS_SOFT: U1#4.W13(IO_L21N_2) ; harness JTAG.TMS
CLK_ENA: U1#4.U10(IO_L14P_2/D5) ; harness GATE_CLOCKS.EN
CLK_EXTA0: U1#4.Y13(IO_L21P_2)
CLK_EXTA1: U1#4.U13(IO_L22P_2/AWAKE)
CLK_EXTA2: U1#4.V13(IO_L22N_2/DOUT)
CLKGEN_CS_N: U1#4.E9(IO_L22P_0) ; port CLK_PLL.CS_N  [project net HOST_CLK.CS_N]
CLKGEN_DIN: U1#4.A2(IO_L32P_0/VREF_0) ; port CLK_PLL.DIN  [project net HOST_CLK.DIN]
CLKGEN_SCLK: U1#4.A8(IO_L18N_0/GCLK11) ; port CLK_PLL.SCLK  [project net HOST_CLK.SCLK]
CLKOE: U1#4.W8(IO_L12N_2/D6) ; port RTC.CLKOE  [project net HOST_RTC.CLKOE]
CLKOUT: U1#4.V12(IO_L18N_2/GCLK3) ; port RTC.CLKOUT  [project net HOST_RTC.CLKOUT]
DAU_SPI_CLK: U1#4.W1(IO_L38P_3) ; port DB_SPI.CLK  [project net DB_SPI.CLK]
DAU_SPI_DIN: U1#4.U1(IO_L34P_3) ; port DB_SPI.DOUT  [project net DB_SPI.DOUT]
DAU_SPI_DOUT: U1#4.N1(IO_L25P_3) ; port DB_SPI.DIN  [project net DB_SPI.DIN]
DAU_SPI_MODE: U1#4.J1(IO_L17P_3/LHCLK0) ; port DB_SPI.MODE  [project net DB_SPI.MODE]
DAU_SPI_SEL: U1#4.R3(IO_L30N_3) ; port DB_SPI.SEL  [project net DB_SPI.SEL]
DB_CLK1: R1_HOST.1 U1#4.A9(IO_L18P_0/GCLK10)
DB_CLOCKS.FPGA_CLK1: R1_HOST.2 ; port DB_CLOCKS.FPGA_CLK1
DIAG_CLK: U1#4.Y15(IO_L26P_2/D2) ; port DIAGCOMMS.SCLK  [project net DIAGCOMMS.SCLK]
DIAG_CS_N: R99.1 U1#4.Y16(IO_L28P_2) ; port DIAGCOMMS.FLASH_CS_N  [project net DIAGCOMMS.FLASH_CS_N]
DIAG_DIN: U1#4.V17(IO_L31P_2) ; port DIAGCOMMS.DIN  [project net DIAGCOMMS.DIN]
DIAG_DOUT: U1#4.T17(IO_L03P_1/A0) ; port DIAGCOMMS.DOUT  [project net DIAGCOMMS.DOUT]
EXTSPI_CSA_N0: U1#4.R13(IO_L23N_2)
EXTSPI_CSA_N1: U1#4.W14(IO_L24N_2/D3)
EXTSPI_DIN: U1#4.Y14(IO_L24P_2/INIT_B) ; port EXTSPI.DIN  [project net PB_SPI.DIN]
EXTSPI_DOUT: U1#4.V14(IO_L25P_2) ; port EXTSPI.DOUT  [project net PB_SPI.DOUT]
EXTSPI_SCLK: U1#4.W10(IO_L16N_2/GCLK15) ; port EXTSPI.SCLK  [project net PB_SPI.SCLK]
FLASH_BOOT_CLK: U1#4.E11(IO_L15N_0/GCLK5) ; port FLASH_BOOT.SCLK  [project net BOOT_FLASH.SCLK]
FLASH_BOOT_CS_N: U1#4.U17(IO_L31N_2) ; port FLASH_BOOT.FLASH_CS_N  [project net BOOT_FLASH.FLASH_CS_N]
FLASH_BOOT_DIN: U1#4.V20(IO_L01N_1/LDC2) ; port FLASH_BOOT.DIN  [project net BOOT_FLASH.DIN]
FLASH_BOOT_DOUT: U1#4.Y18(IO_L30N_2) ; port FLASH_BOOT.DOUT  [project net BOOT_FLASH.DOUT]
FLASH_GOLD_CLK: U1#4.Y19(IO_L32N_2/CCLK) ; port FLASH_GOLDEN.SCLK  [project net GOLD_FLASH.SCLK]
FLASH_GOLD_CS_N: U1#4.Y2(IO_L02N_2/CSO_B) ; port FLASH_GOLDEN.FLASH_CS_N  [project net GOLD_FLASH.FLASH_CS_N]
FLASH_GOLD_DIN: U1#4.W12(IO_L20N_2/MOSI/CSI_B) ; port FLASH_GOLDEN.DIN  [project net GOLD_FLASH.DIN]
FLASH_GOLD_DOUT: U1#4.W18(IO_L32P_2/D0/DIN/MISO) ; port FLASH_GOLDEN.DOUT  [project net GOLD_FLASH.DOUT]
FPGA_CCLK: U1#4.V10(IO_L16P_2/GCLK14) ; port DB_PROGRAM.CCLK  [project net DB_PROGRAM.CCLK]
FPGA_CLK: U1#4.C10(IO_L16N_0/GCLK7) ; port CLK_PLL.CLK_PROG, port DB_CLOCKS.FPGA_CLK  [project net DB_CLOCKS.FPGA_CLK]
FPGA_DIN: U1#4.T1(IO_L32P_3/VREF_3) ; port DB_PROGRAM.DIN  [project net DB_PROGRAM.DIN]
FPGA_DONE: U1#4.R2(IO_L30P_3) ; port DB_PROGRAM.DONE  [project net DB_PROGRAM.DONE]
FPGA_ID0: U1#4.E20(IO_L32P_1)
FPGA_ID1: U1#4.R4(IO_L33N_3)
FPGA_ID2: U1#4.F20(IO_L29P_1/A16)
FPGA_ID3: U1#4.R1(IO_L28N_3)
FPGA_INIT: U1#4.U3(IO_L34N_3) ; port DB_PROGRAM.INIT  [project net DB_PROGRAM.INIT]
FPGA_M0: U1#4.R5(IO_L36P_3)
FPGA_M1: U1#4.V2(IO_L37N_3)
FPGA_M2: U1#4.U5(IO_L05N_2)
FPGA_PROG_CLK: port DB_PROGRAM.PROG_CLK  [project net DB_PROGRAM.PROG_CLK]
FPGA_PROG_PWR_ON: port DB_PROGRAM.PROG_PWR_ON  [project net DB_PROGRAM.PROG_PWR_ON]
FPGA_PROGRAM: U1#4.R7(IO_L04N_2) ; port DB_PROGRAM.PROGRAM  [project net DB_PROGRAM.PROGRAM]
FPGA_TCK: U1#4.E10(IO_L17N_0/GCLK9) ; harness JTAG.TCK
FPGA_TDI: U1#4.T6(IO_L04P_2) ; harness JTAG.TDI
FPGA_TDO: U1#4.W2(IO_L38N_3) ; harness JTAG.TDO
FPGA_TMS: U1#4.V1(IO_L37P_3) ; harness JTAG.TMS
HOST_HARD_TCK: sheet HOST_NonIO/TCK, harness JTAG.TCK
HOST_HARD_TDI: sheet HOST_NonIO/TDI, harness JTAG.TDI
HOST_HARD_TDO: sheet HOST_NonIO/TDO, harness JTAG.TDO
HOST_HARD_TMS: sheet HOST_NonIO/TMS, harness JTAG.TMS
HOST_M0: R1#3.1 U1#4.V4(IO_L01N_2/M0)
HOST_M1: J1#2.1 R2#3.1 U1#4.U4(IO_L01P_2/M1)
HOST_M2: R3#3.1 U1#4.W3(IO_L02P_2/M2)
HOST_SOFT_TCK: U1#4.D10(IO_L17P_0/GCLK8) ; harness JTAG.TCK
HOST_SOFT_TDI: U1#4.F3(IO_L09P_3) ; harness JTAG.TDI
HOST_SOFT_TDO: U1#4.F2(IO_L10N_3) ; harness JTAG.TDO
HOST_SOFT_TMS: U1#4.F7(IO_L27N_0) ; harness JTAG.TMS
HOST_VS0: R269.1 U1#4.W6(IO_L09N_2/VS0)
HOST_VS1: R270.1 U1#4.V6(IO_L09P_2/VS1)
HOST_VS2: R271.1 U1#4.U7(IO_L07N_2/VS2)
HUSB_D0: U1#4.H4(IO_L08N_3)
HUSB_D1: U1#4.F6(IO_L31N_0)
HUSB_D2: U1#4.H6(IO_L08P_3)
HUSB_D3: U1#4.G3(IO_L12P_3)
HUSB_D4: U1#4.G5(IO_L06N_3)
HUSB_D5: U1#4.G4(IO_L09N_3)
HUSB_D6: U1#4.J2(IO_L16N_3)
HUSB_D7: U1#4.H3(IO_L14N_3)
HUSB_D8: U1#4.P3(IO_L29P_3)
HUSB_D9: U1#4.M5(IO_L24N_3)
HUSB_D10: U1#4.P1(IO_L28P_3)
HUSB_D11: U1#4.M4(IO_L24P_3)
HUSB_D12: U1#4.N4(IO_L26N_3)
HUSB_D13: U1#4.M3(IO_L22N_3)
HUSB_D14: U1#4.N3(IO_L26P_3)
HUSB_D15: U1#4.M2(IO_L22P_3/VREF_3)
HUSB_FIFOADR0: U1#4.L1(IO_L21P_3/TRDY2/LHCLK6) ; port HOSTUSB.FIFOADR0  [project net HOST_USB.FIFOADR0]
HUSB_FIFOADR1: U1#4.L3(IO_L18N_3/IRDY2/LHCLK3) ; port HOSTUSB.FIFOADR1  [project net HOST_USB.FIFOADR1]
HUSB_FIFOADR2: U1#4.K3(IO_L18P_3/LHCLK2) ; port HOSTUSB.FIFOADR2  [project net HOST_USB.FIFOADR2]
HUSB_FLAGA: U1#4.G1(IO_L13N_3/VREF_3) ; port HOSTUSB.FLAGA  [project net HOST_USB.FLAGA]
HUSB_FLAGB: U1#4.J3(IO_L16P_3) ; port HOSTUSB.FLAGB  [project net HOST_USB.FLAGB]
HUSB_FLAGC: U1#4.J4(IO_L14P_3) ; port HOSTUSB.FLAGC  [project net HOST_USB.FLAGC]
HUSB_FLAGD_CS_N: U1#4.M1(IO_L21N_3/LHCLK7) ; port HOSTUSB.FLAGD_CS_N  [project net HOST_USB.FLAGD_CS_N]
HUSB_IFCLK: U1#4.H2(IO_L12N_3) ; port HOSTUSB.IFCLK  [project net HOST_USB.IFCLK]
HUSB_INT_N: U1#4.J6(IO_L07P_3) ; port HOSTUSB.INT_N  [project net HOST_USB.INT_N]
HUSB_PKTEND: U1#4.L5(IO_L20N_3/LHCLK5) ; port HOSTUSB.PKTEND  [project net HOST_USB.PKTEND]
HUSB_RD_N: U1#4.N2(IO_L25N_3) ; port HOSTUSB.RD_N  [project net HOST_USB.RD_N]
HUSB_READY: U1#4.J5(IO_L07N_3) ; port HOSTUSB.READY  [project net HOST_USB.READY]
HUSB_RESET_N: U1#4.P4(IO_L29N_3) ; port HOSTUSB.RESET_N  [project net HOST_USB.RESET_N]
HUSB_SLOE: U1#4.K2(IO_L17N_3/LHCLK1) ; port HOSTUSB.SLOE  [project net HOST_USB.SLOE]
HUSB_VBUS: U1#4.F1(IO_L13P_3) ; port HOSTUSB.VBUS  [project net HOST_USB.VBUS]
HUSB_WR_N: U1#4.K4(IO_L20P_3/LHCLK4) ; port HOSTUSB.WR_N  [project net HOST_USB.WR_N]
LED1_BLUE: U1#4.T7(IO_L06P_2) ; port LED1.BLUE  [project net HOST_LED1.BLUE]
LED1_GREEN: U1#4.Y6(IO_L10P_2) ; port LED1.GREEN  [project net HOST_LED1.GREEN]
LED1_RED: U1#4.U6(IO_L06N_2) ; port LED1.RED  [project net HOST_LED1.RED]
LED2_BLUE: U1#4.W4(IO_L03N_2) ; port LED2.BLUE  [project net HOST_LED2.BLUE]
LED2_GREEN: U1#4.Y4(IO_L08P_2) ; port LED2.GREEN  [project net HOST_LED2.GREEN]
LED2_RED: U1#4.Y5(IO_L08N_2) ; port LED2.RED  [project net HOST_LED2.RED]
NEXUS_TCK: U1#4.W9(IO_L15P_2/GCLK12) ; harness JTAG.TCK
NEXUS_TDI: U1#4.T4(IO_L36N_3) ; harness JTAG.TDI
NEXUS_TDO: U1#4.T3(IO_L33P_3) ; harness JTAG.TDO
NEXUS_TMS: U1#4.T2(IO_L32N_3) ; harness JTAG.TMS
ONE_WIRE_ID: U1#4.A14(IO_L07N_0) ; port 1WID.DATA  [project net HOST_ID.DATA]
ONE_WIRE_PB_ID_A: U1#4.V15(IO_L26N_2/D1) ; harness ONE_WIRE.ID
ONE_WIRE_PIOA1: U1#4.V16(IO_L29P_2)
ONE_WIRE_PIOA2: U1#4.U15(IO_L27P_2)
PB_SPAREA1: U1#4.V9(IO_L13N_2)
PB_SPAREA2: U1#4.T10(IO_L14N_2/D4)
PB_SPAREA3: U1#4.Y12(IO_L20P_2)
PB_SPAREA4: U1#4.U16(IO_L29N_2)
REF_CLK: U1#4.A10(IO_L16P_0/GCLK6) ; port CLK_PLL.CLK_FIXED, port DB_CLOCKS.REF_CLK  [project net DB_CLOCKS.REF_CLK]
RTC_CS: U1#4.T9(IO_L11P_2) ; port RTC.CS_N  [project net HOST_RTC.CS_N]
RTC_DIN: U1#4.V5(IO_L05P_2) ; port RTC.DIN  [project net HOST_RTC.DIN]
RTC_DOUT: U1#4.Y3(IO_L03P_2) ; port RTC.DOUT  [project net HOST_RTC.DOUT]
RTC_INT_N: U1#4.C13(IO_L10N_0/VREF_0) ; port RTC.INT_N  [project net HOST_RTC.INT_N]
RTC_SCLK: U1#4.U11(IO_L18P_2/GCLK2) ; port RTC.SCLK  [project net HOST_RTC.SCLK]
SD_CLK: U1#4.D11(IO_L15P_0/GCLK4) ; port SD.CLK  [project net HOST_SD.CLK]
SD_CMD: U1#4.U20(IO_L06N_1) ; port SD.CMD  [project net HOST_SD.CMD]
SD_DAT0: U1#4.U19(IO_L06P_1)
SD_DAT1: U1#4.V19(IO_L02P_1/LDC1)
SD_DAT2: U1#4.P20(IO_L10N_1/VREF_1)
SD_DAT3: U1#4.T20(IO_L05N_1)
SD_DETECT: U1#4.Y17(IO_L30P_2) ; port SD.DETECT  [project net HOST_SD.DETECT]
SD_PROTECT: U1#4.W20(IO_L01P_1/HDC) ; port SD.PROTECT  [project net HOST_SD.PROTECT]
SRAM_A0: U1#4.F4(IO_L06P_3)
SRAM_A1: U1#4.E1(IO_L05N_3)
SRAM_A2: U1#4.E3(IO_L10P_3)
SRAM_A3: U1#4.F8(IO_L23N_0)
SRAM_A4: U1#4.D1(IO_L05P_3)
SRAM_A5: U1#4.B1(IO_L02P_3)
SRAM_A6: U1#4.C4(IO_L29N_0)
SRAM_A7: U1#4.B2(IO_L32N_0/PUDC_B)
SRAM_A8: U1#4.C5(IO_L28P_0)
SRAM_A9: U1#4.B3(IO_L30N_0)
SRAM_A10: U1#4.A12(IO_L13N_0)
SRAM_A11: U1#4.B13(IO_L11P_0)
SRAM_A12: U1#4.B12(IO_L13P_0)
SRAM_A13: U1#4.C12(IO_L11N_0)
SRAM_A14: U1#4.B11(IO_L14P_0)
SRAM_A15: U1#4.A3(IO_L30P_0)
SRAM_A16: U1#4.D8(IO_L21N_0)
SRAM_A17: U1#4.C6(IO_L25N_0)
SRAM_A18: U1#4.C11(IO_L14N_0)
SRAM_D0: U1#4.D2(IO_L03N_3)
SRAM_D1: U1#4.D3(IO_L01N_3)
SRAM_D2: U1#4.E7(IO_L27P_0)
SRAM_D3: U1#4.D4(IO_L01P_3)
SRAM_D4: U1#4.E6(IO_L31P_0)
SRAM_D5: U1#4.C1(IO_L03P_3)
SRAM_D6: U1#4.E8(IO_L23P_0)
SRAM_D7: U1#4.C2(IO_L02N_3)
SRAM_D8: U1#4.B9(IO_L19P_0)
SRAM_D9: U1#4.A7(IO_L24N_0)
SRAM_D10: U1#4.B8(IO_L20P_0)
SRAM_D11: U1#4.A6(IO_L25P_0)
SRAM_D12: U1#4.C9(IO_L19N_0)
SRAM_D13: U1#4.B7(IO_L24P_0)
SRAM_D14: U1#4.A5(IO_L26P_0)
SRAM_D15: U1#4.C8(IO_L20N_0)
SRAM_NBHE: U1#4.C7(IO_L21P_0) ; port SRAM.NBHE  [project net HOST_SRAM.NBHE]
SRAM_NBLE: U1#4.A4(IO_L29P_0) ; port SRAM.NBLE  [project net HOST_SRAM.NBLE]
SRAM_NCS: U1#4.F9(IO_L22N_0/VREF_0) ; port SRAM.NCS  [project net HOST_SRAM.NCS]
SRAM_NOE: U1#4.B5(IO_L26N_0) ; port SRAM.NOE  [project net HOST_SRAM.NOE]
SRAM_NWE: U1#4.D6(IO_L28N_0) ; port SRAM.NWE  [project net HOST_SRAM.NWE]
USERFLASH1_CS_N: U1#4.U18(IO_L02N_1/LDC0) ; port FLASH_USER.FLASH1_CS_N  [project net USER_FLASH.FLASH1_CS_N]
USERFLASH2_CS_N: U1#4.T12(IO_L19P_2) ; port FLASH_USER.FLASH2_CS_N  [project net USER_FLASH.FLASH2_CS_N]
USERFLASH_DIN: U1#4.T15(IO_L27N_2) ; port FLASH_USER.DIN  [project net USER_FLASH.DIN]
USERFLASH_DOUT: U1#4.T14(IO_L25N_2) ; port FLASH_USER.DOUT  [project net USER_FLASH.DOUT]
USERFLASH_SCLK: U1#4.T13(IO_L23P_2) ; port FLASH_USER.SCLK  [project net USER_FLASH.SCLK]

Not connected (* = marked no-connect by the designer): U1#4 A15(IO_L08N_0)* A16(IO_L05N_0)* A17(IO_L04N_0)* A18(IO_L01N_0)* B15(IO_L08P_0)* B17(IO_L04P_0/VREF_0)* B18(IO_L01P_0)* B19(IO_L38N_1/A25)* B20(IO_L38P_1/A24)* C14(IO_L07P_0)* C15(IO_L06N_0)* C16(IO_L05P_0)* C17(IO_L02N_0)* C19(IO_L37N_1/A23)* C20(IO_L37P_1/A22)* D12(IO_L12P_0)* D14(IO_L10P_0)* D15(IO_L06P_0)* D16(IO_L03P_0)* D17(IO_L02P_0/VREF_0)* D18(IO_L34N_1)* D20(IO_L34P_1)* E13(IO_L09P_0)* E14(IP_0)* E15(IO_L03N_0)* E18(IO_L33P_1)* E19(IO_L32N_1)* F11(IP_0)* F12(IO_L12N_0)* F13(IO_L09N_0)* F14(IP_0)* F16(IO_L36N_1/A21)* F17(IO_L33N_1)* F18(IO_L30N_1/A19)* F19(IO_L29N_1/A17)* G6(IP_L04N_3/VREF_3)* G7(IP_L04P_3)* G8(IP_0)* G9(IP_0)* G10(IP_0)* G11(IP_0/VREF_0)* G12(IP_0)* G13(IP_0)* G14(IP_L39N_1)* G15(IP_L39P_1/VREF_1)* G16(IO_L36P_1/A20)* G17(IO_L30P_1/A18)* G18(IO_L28P_1)* G20(IO_L26N_1/A15)* H7(IP_3)* H9(IP_0)* H10(IP_0)* H11(IP_0)* H12(IP_0)* H14(IP_L35N_1)* H15(IP_L35P_1)* H17(IO_L28N_1)* H18(IO_L25N_1/A13)* H19(IO_L25P_1/A12)* H20(IO_L26P_1/A14)* J7(IP_L11N_3/VREF_3)* J8(IP_L11P_3)* J13(IP_L31N_1)* J14(IP_L31P_1/VREF_1)* J15(IP_L27N_1)* J16(IP_L27P_1)* J17(IO_L24P_1)* J18(IO_L22N_1/A11)* J19(IO_L22P_1/A10)* J20(IO_L21N_1/RHCLK7)* K5(IP_L19N_3)* K6(IP_L19P_3)* K7(IP_L15N_3)* K8(IP_L15P_3)* K14(IP_L23N_1)* K15(IP_L23P_1/VREF_1)* K16(IO_L24N_1)* K18(IO_L20P_1/RHCLK4)* K20(IO_L21P_1/IRDY1/RHCLK6)* L6(IP_L23N_3)* L7(IP_L23P_3)* L13(IP_L19N_1)* L14(IP_L19P_1)* L15(IO_L16P_1/A8)* L16(IO_L16N_1/A9)* L17(IO_L20N_1/RHCLK5)* L18(IO_L18N_1/TRDY1/RHCLK3)* L19(IO_L18P_1/RHCLK2)* M6(IP_L31P_3)* M7(IP_L27N_3)* M8(IP_L27P_3)* M13(IP_L15N_1)* M14(IP_L15P_1/VREF_1)* M15(IP_L11N_1/VREF_1)* M16(IP_L11P_1)* M17(IO_L14P_1/A6)* M18(IO_L14N_1/A7)* M19(IO_L17P_1/RHCLK0)* M20(IO_L17N_1/RHCLK1)* N6(IP_L35N_3)* N7(IP_L31N_3)* N9(IP_2/VREF_2)* N12(IP_2/VREF_2)* N14(IP_1/VREF_1)* N15(IO_L12P_1/A2)* N17(IO_L12N_1/A3)* N18(IO_L13P_1/A4)* N19(IO_L13N_1/A5)* P5(IP_L35P_3)* P6(IP_L39P_3)* P7(IP_L39N_3/VREF_3)* P8(IP_2/VREF_2)* P9(IP_2)* P10(IP_2/VREF_2)* P11(IP_2/VREF_2)* P12(IP_2)* P13(IP_2)* P14(IP_L04P_1)* P15(IP_L04N_1/VREF_1)* P16(IO_L07P_1)* P17(IO_L07N_1)* P18(IO_L10P_1)* R8(IP_2)* R10(IP_2)* R14(IP_2/VREF_2)* R16(IO_L03N_1/A1)* R17(IO_L08N_1)* R18(IO_L08P_1)* R19(IO_L09P_1)* R20(IO_L09N_1)* T11(IP_2)* T18(IO_L05P_1)*

### Buses and harness runs
bus CLK_EXTA[2..0]
bus EXTSPI_CSA_N[1..0]
bus FPGA_ID[3..0]
bus FPGA_M[2..0]
bus HUSB_D[15..0]
bus ONE_WIRE_PIOA[1..2]
bus PB_SPAREA[1..4]
bus SD_DAT[3..0]
bus SRAM_A[18..0]
bus SRAM_D[15..0]

### Notes on the sheet
- SYSTEM CLOCKS
- HOST RTC
- USER FPGA JTAG
- HOST USB
- PB - Control
- SRAM - 64K/256K x 16
- ONE WIRE ID
- USER FPGA PROGRAM
- USB2
- USER 8MB SPI FLASH x2
- HOST AUDIO - Delta-Sigma
- SYSBOOT
- PB SPI
- HOST JTAG
- USER FPGA SPI
- HOST SD CARD
- Host LEDs
- GOLDEN
- (near J1#2) PLATFORM UPGRADE
- HSWAP
- HSWAP HIGH = INT PULLUPS OFF
- (INT PULLED UP VIA FIXED RESISTOR)
- HSWAP LOW= INT PULLUPS ON
- XC3S1400AN MODE PIN CONFIGURATIONS
- M2  M1  M0
- FUNCTION:
- 0
- 1
- PLATFORM FLASH MODE
- SPI MODE (MASTER)
- BYTE PARALLED INTERFACE
- INTERNAL MASTER SPI FLASH
- <RESERVED>
- JTAG MODE
- SLAVE PARALLEL
- SLAVE SERIAL
- M0
- START ADD = 0x00_0000 INCREMENTING
- (INT PULL UP VIA HSWAP)
- START ADD = 0xFF_FFFF DECREMENTING
- M1
- MUST BE PULLED HIGH DURING CONFIG
- M2
- MUST BE PULLED LOW DURING CONFIG
- XC3S1400AN SPI MODE CONFIGURATIONS
- VS2 VS1 VS0
- 1V2
- (0x03) STANDARD READ
- (0xE8) READ ARRAY
- (0x0B) SPI FAST READ
- 3V3
- VS0
- SPI SET TO FAST (0x0B)
- SPI ACCESS SPEED (INT PULL UP VIA HSWAP)
- VCCO_2
- VS1
- VS2
- PROG_B
- DONE
- Project Title
- Sheet Title
- Size:
- Date:
- File:
- A2
- Assy:
- Time:
- Revision:
- Sheet
- of
- (in symbol D-241-0024, part A) BANK 0
- (in symbol D-241-0024, part B) BANK 1
- (in symbol D-241-0024, part C) BANK 2
- (in symbol D-241-0024, part D) BANK 3

### Library data of the parts
J1#2 = D-300-0020: Header IDC, 2 x 1 Pin Vertical 2.54mm Pitch (Non-Boxed, Male); Max Current: 3 A; Category: Connector; Connector type: Header; Mounting Technology: Through-Hole; Pin Count: 2; Status: Production
R1#3 R2#3 R3#3 R99 R269-R271 = D-100-0107: Resistor, 2K2 1% 0402 (1005); Power Rating: 63 mW; Resistance: 2.2 K; Category: Resistor; Mounting Technology: Surface Mount; Status: Production; Tolerance: 1 %
R1_HOST = D-100-0085: Resistor, 5R6 1% 0402 (1005); Power Rating: 63 mW; Resistance: 5.6 R; Category: Resistor; Status: Production; Mounting Technology: Surface Mount; Tolerance: 1 %
U1#4 = D-241-0024: FPGA, Xilinx Spartan3-400 Standard Speed, BGA 1.0mm pitch, 400 balls, 0 to 85 degC; Supply Voltage: 1.2, 2.5, and 3.3 V; Mounting Technology: Surface Mount; Status: Unreleased; Technology: SRAM; Temperature Range: 0 to 85; Category: IC-FPGA; NexusDeviceId: XC3S400AN-4FGG400C

## Sheet HOST_FPGA_NonIO.SchDoc: HOST FPGA Pwr and Programming
size A4; Organization: Altium Limited.; Address1: Level 3, 12a Rodborough Rd; Address2: Frenchs Forest 2086; Address3: NSW; Address4: AUSTRALIA; DocumentNumber: 22; SheetNumber: 23; SheetTotal: 78
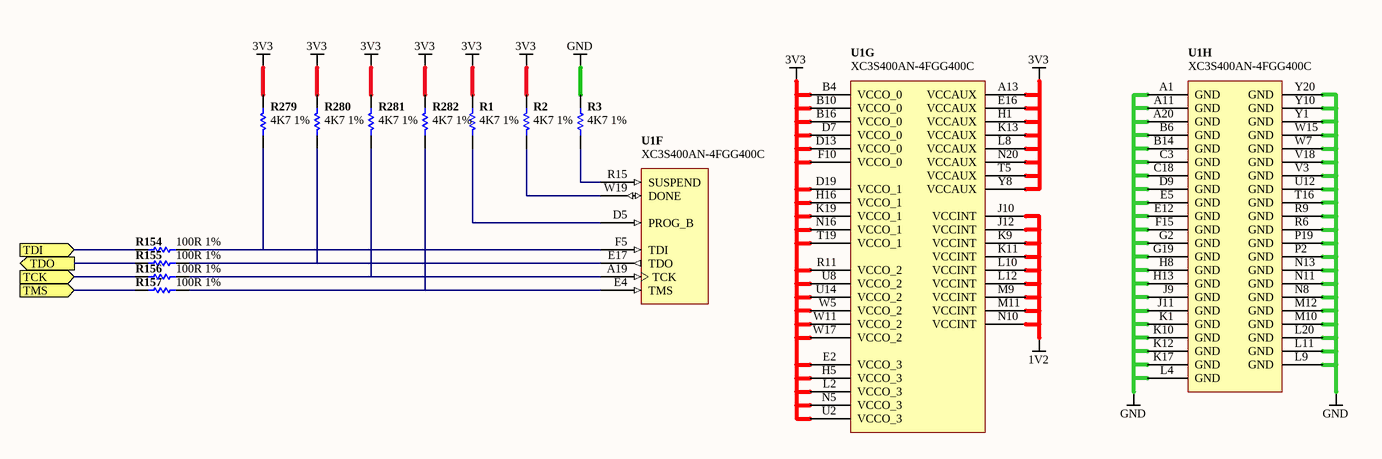
[diagram p11: HOST_FPGA_NonIO.SchDoc]

### Parts
(Parts that share a designator on the sheet are numbered #1, #2 ... from top to bottom, then left to right.)
R1#4  4K7 1%  [RESC1005-STAR]
R2#4  4K7 1%  [RESC1005-STAR]
R3#4  4K7 1%  [RESC1005-STAR]
R154#1  100R 1%  [RESC1005-STAR]
R155  100R 1%  [RESC1005-STAR]
R156  100R 1%  [RESC1005-STAR]
R157  100R 1%  [RESC1005-STAR]
R279  4K7 1%  [RESC1005-STAR]
R280  4K7 1%  [RESC1005-STAR]
R281  4K7 1%  [RESC1005-STAR]
R282  4K7 1%  [RESC1005-STAR]
U1#4  XC3S400AN-4FGG400C  [FGG400]  (parts F,G,H of 8)

### Ports
TCK (in), TDI (in), TDO (out), TMS (in)

### Nets
1V2: U1#4.J10(VCCINT) U1#4.J12(VCCINT) U1#4.K9(VCCINT) U1#4.K11(VCCINT) U1#4.L10(VCCINT) U1#4.L12(VCCINT) U1#4.M9(VCCINT) U1#4.M11(VCCINT) U1#4.N10(VCCINT)
3V3: R1#4.1 R2#4.1 R279.1 R280.1 R281.1 R282.1 U1#4.A13(VCCAUX) U1#4.B4(VCCO_0) U1#4.B10(VCCO_0) U1#4.B16(VCCO_0) U1#4.D7(VCCO_0) U1#4.D13(VCCO_0) U1#4.D19(VCCO_1) U1#4.E2(VCCO_3) U1#4.E16(VCCAUX) U1#4.F10(VCCO_0) U1#4.H1(VCCAUX) U1#4.H5(VCCO_3) U1#4.H16(VCCO_1) U1#4.K13(VCCAUX) U1#4.K19(VCCO_1) U1#4.L2(VCCO_3) U1#4.L8(VCCAUX) U1#4.N5(VCCO_3) U1#4.N16(VCCO_1) U1#4.N20(VCCAUX) U1#4.R11(VCCO_2) U1#4.T5(VCCAUX) U1#4.T19(VCCO_1) U1#4.U2(VCCO_3) U1#4.U8(VCCO_2) U1#4.U14(VCCO_2) U1#4.W5(VCCO_2) U1#4.W11(VCCO_2) U1#4.W17(VCCO_2) U1#4.Y8(VCCAUX)
GND: R3#4.1 U1#4.A1(GND) U1#4.A11(GND) U1#4.A20(GND) U1#4.B6(GND) U1#4.B14(GND) U1#4.C3(GND) U1#4.C18(GND) U1#4.D9(GND) U1#4.E5(GND) U1#4.E12(GND) U1#4.F15(GND) U1#4.G2(GND) U1#4.G19(GND) U1#4.H8(GND) U1#4.H13(GND) U1#4.J9(GND) U1#4.J11(GND) U1#4.K1(GND) U1#4.K10(GND) U1#4.K12(GND) U1#4.K17(GND) U1#4.L4(GND) U1#4.L9(GND) U1#4.L11(GND) U1#4.L20(GND) U1#4.M10(GND) U1#4.M12(GND) U1#4.N8(GND) U1#4.N11(GND) U1#4.N13(GND) U1#4.P2(GND) U1#4.P19(GND) U1#4.R6(GND) U1#4.R9(GND) U1#4.T16(GND) U1#4.U12(GND) U1#4.V3(GND) U1#4.V18(GND) U1#4.W7(GND) U1#4.W15(GND) U1#4.Y1(GND) U1#4.Y10(GND) U1#4.Y20(GND)
HOST_HARD_TCK: R156.1 ; port TCK
HOST_HARD_TDI: R154#1.1 ; port TDI
HOST_HARD_TDO: R155.1 ; port TDO
HOST_HARD_TMS: R157.1 ; port TMS
NetR1#4_2: R1#4.2 U1#4.D5(PROG_B)
NetR2#4_2: R2#4.2 U1#4.W19(DONE)
NetR3#4_2: R3#4.2 U1#4.R15(SUSPEND)
NetR154#1_2: R154#1.2 R279.2 U1#4.F5(TDI)
NetR155_2: R155.2 R280.2 U1#4.E17(TDO)
NetR156_2: R156.2 R281.2 U1#4.A19(TCK)
NetR157_2: R157.2 R282.2 U1#4.E4(TMS)

### Notes on the sheet
- Sheet Title
- Project Title
- Size:
- Date:
- A4
- Assy:
- Time:
- Revision:
- Sheet
- of
- File:

### Library data of the parts
R1#4 R2#4 R3#4 R279-R282 = D-100-0088: Resistor, 4K7 1% 0402 (1005); Power Rating: 63 mW; Resistance: 4.7 K; Category: Resistor; Mounting Technology: Surface Mount; Status: Production; Tolerance: 1 %
R154#1 R155-R157 = D-100-0131: Resistor, 100R 1% 0402 (1005); Power Rating: 63 mW; Mounting Technology: Surface Mount; Resistance: 100 R; Status: Production; Tolerance: 1 %; Category: Resistor
U1#4 = D-241-0024: as U1#4 on sheet Host_FPGA; Mounting Technology: Surface Mount; Status: Unreleased; Technology: SRAM; Temperature Range: 0 to 85; Category: IC-FPGA; NexusDeviceId: XC3S400AN-4FGG400C

## Sheet HOST_JTAG.SchDoc: Local MCU Debug Connector
size A4; DocumentNumber: 24; SheetNumber: 25; SheetTotal: 78
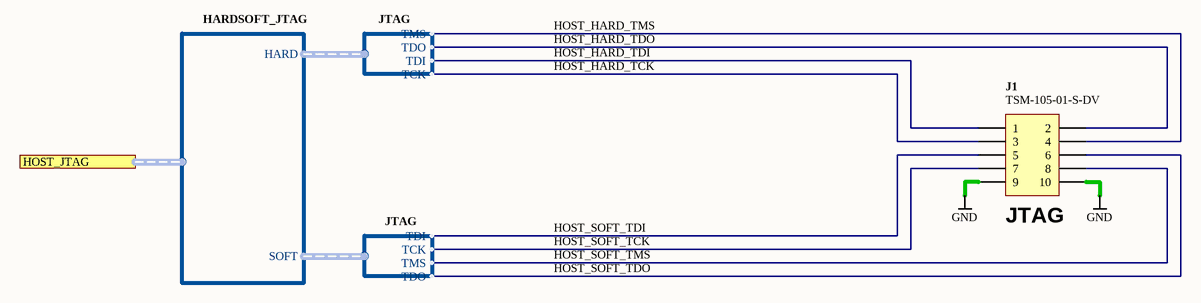
[diagram p12: HOST_JTAG.SchDoc]

### Parts
(Parts that share a designator on the sheet are numbered #1, #2 ... from top to bottom, then left to right.)
J1#3  TSM-105-01-S-DV  [TSM-105-01-DV]

### Ports
HOST_JTAG (harness HARDSOFT_JTAG)

### Harnesses
JTAG: TMS, TDO, TDI, TCK
HARDSOFT_JTAG: HARD, SOFT

### Nets
GND: J1#3.9 J1#3.10
HOST_HARD_TCK: J1#3.3 ; harness JTAG.TCK
HOST_HARD_TDI: J1#3.1 ; harness JTAG.TDI
HOST_HARD_TDO: J1#3.2 ; harness JTAG.TDO
HOST_HARD_TMS: J1#3.4 ; harness JTAG.TMS
HOST_SOFT_TCK: J1#3.7 ; harness JTAG.TCK
HOST_SOFT_TDI: J1#3.5 ; harness JTAG.TDI
HOST_SOFT_TDO: J1#3.6 ; harness JTAG.TDO
HOST_SOFT_TMS: J1#3.8 ; harness JTAG.TMS

### Notes on the sheet
- (near J1#3) JTAG
- Sheet Title
- Project Title
- Size:
- Date:
- A4
- Assy:
- Time:
- Revision:
- Sheet
- of
- File:

### Library data of the parts
J1#3 = D-300-0076: Non-Boxed Header IDC, 2 X 5 Pin SMD; Connector type: Boxed; Max Current: mA; Category: Connector; Mounting Technology: Surface Mount; Status: Unreleased

## Sheet USB_CY7C68001-56LFC.SchDoc: High-Speed USB 2.0 Controller
size A4; Organization: Altium Limited.; Address1: Level 3, 12a Rodborough Rd; Address2: Frenchs Forest 2086; Address3: NSW; Address4: AUSTRALIA; DocumentNumber: 49; SheetNumber: 50; SheetTotal: 78
Used 2 times, as channels DBUSB_TXRX, DBUSB_TXRX. Parts and nets are listed once, with the designators drawn on the sheet.
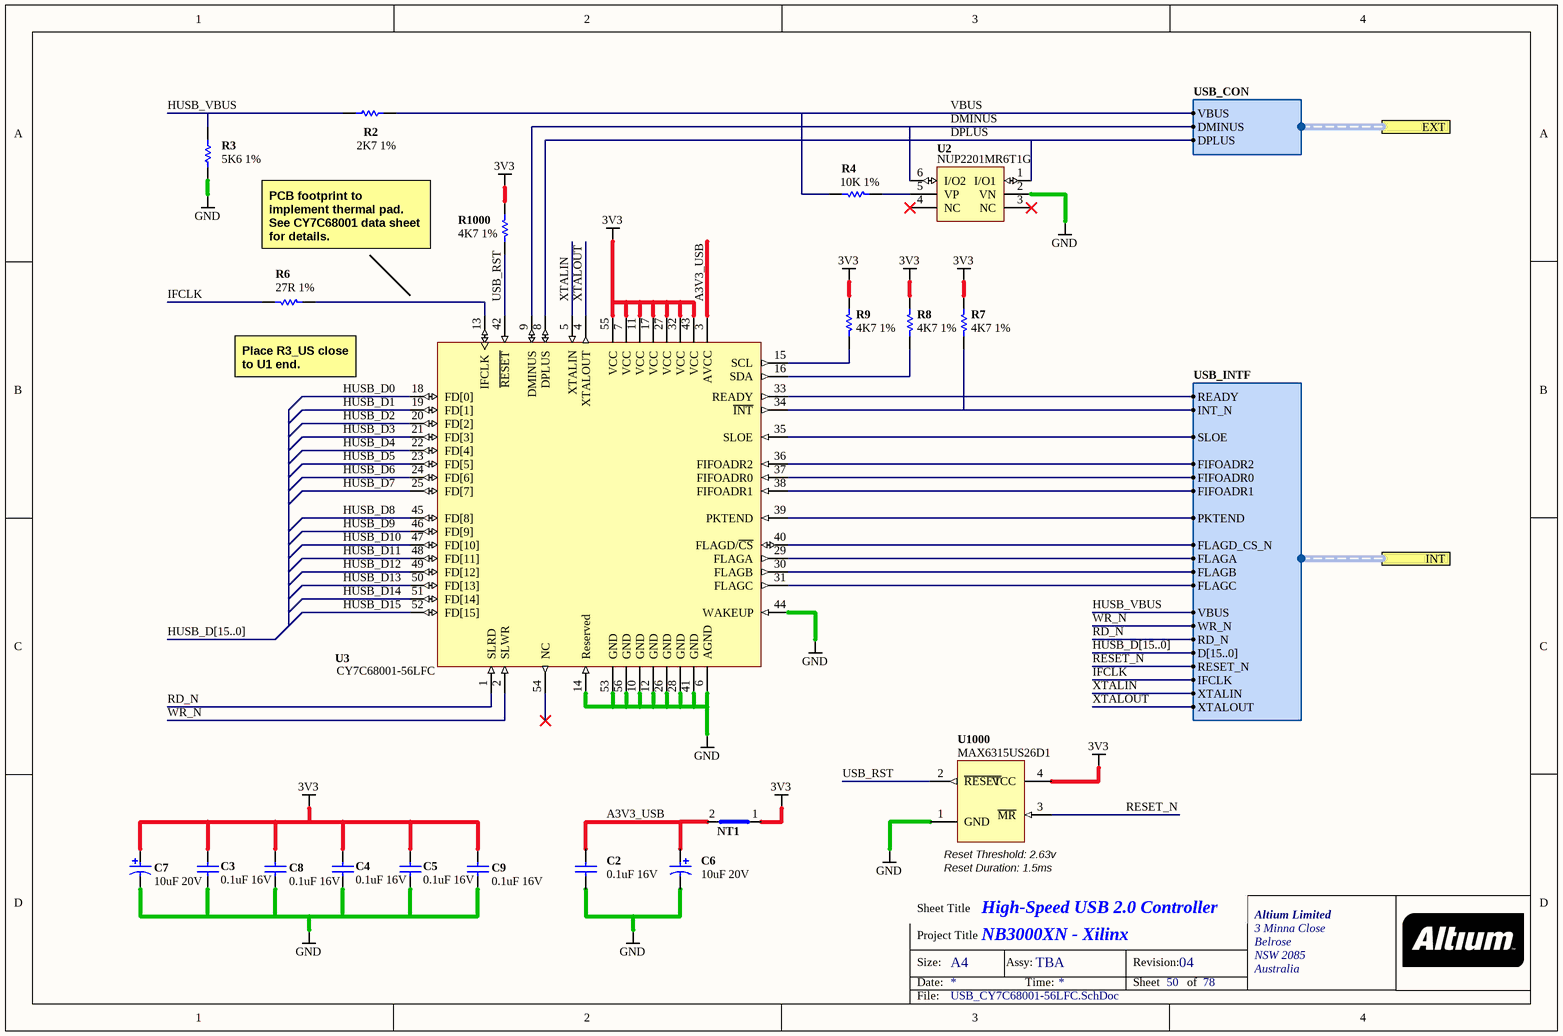
[diagram p13: USB_CY7C68001-56LFC.SchDoc]

### Parts
C2  0.1uF 16V  [CAPC1005-STAR]
C3  0.1uF 16V  [CAPC1005-STAR]
C4  0.1uF 16V  [CAPC1005-STAR]
C5  0.1uF 16V  [CAPC1005-STAR]
C6  10uF 20V  [CAPC3528-STAR]
C7  10uF 20V  [CAPC3528-STAR]
C8  0.1uF 16V  [CAPC1005-STAR]
C9  0.1uF 16V  [CAPC1005-STAR]
NT1  Net Tie SMT2  [NETTIE-SMT2-31X51]  (value not drawn)  (net tie, no BOM)
R2  2K7 1%  [RESC1005-STAR]
R3  5K6 1%  [RESC1005-STAR]
R4  10K 1%  [RESC1005-STAR]
R6  27R 1%  [RESC1005-STAR]
R7  4K7 1%  [RESC1005-STAR]
R8  4K7 1%  [RESC1005-STAR]
R9  4K7 1%  [RESC1005-STAR]
R1000  4K7 1%  [RESC1005-STAR]
U2  NUP2201MR6T1G  [TSOP95P275-6]
U3  CY7C68001-56LFC  [QFN50P800X800_HS-57]
U1000  MAX6315US26D1  [SOT143]

### Ports
EXT (harness USB_CON), INT (harness USB_INTF)

### Harnesses
USB_INTF: READY, INT_N, SLOE, FIFOADR2, FIFOADR0, FIFOADR1, PKTEND, FLAGD_CS_N, FLAGA, FLAGB, FLAGC, WR_N, RD_N, D[15..0], RESET_N, IFCLK, XTALIN, VBUS, XTALOUT
USB_CON: VBUS, DMINUS, DPLUS

### Nets
3V3: C3.2 C4.2 C5.2 C7.1 C8.1 C9.1 NT1.1(Net1) R7.2 R8.1 R9.1 R1000.2 U3.7(VCC) U3.11(VCC) U3.17(VCC) U3.27(VCC) U3.32(VCC) U3.43(VCC) U3.55(VCC) U1000.4(VCC)
GND: C2.1 C3.1 C4.1 C5.1 C6.2 C7.2 C8.2 C9.2 R3.2 U2.2(VN) U3.6(AGND) U3.10(GND) U3.12(GND) U3.14(Reserved) U3.26(GND) U3.28(GND) U3.41(GND) U3.44(WAKEUP) U3.53(GND) U3.56(GND) U1000.1(GND)
A3V3_USB: C2.2 C6.1 NT1.2(Net2) U3.3(AVCC)
DMINUS: U2.6(I/O2) U3.9(DMINUS) ; port EXT.DMINUS
DPLUS: U2.1(I/O1) U3.8(DPLUS) ; port EXT.DPLUS
HUSB_D0: U3.18(FD[0])
HUSB_D1: U3.19(FD[1])
HUSB_D2: U3.20(FD[2])
HUSB_D3: U3.21(FD[3])
HUSB_D4: U3.22(FD[4])
HUSB_D5: U3.23(FD[5])
HUSB_D6: U3.24(FD[6])
HUSB_D7: U3.25(FD[7])
HUSB_D8: U3.45(FD[8])
HUSB_D9: U3.46(FD[9])
HUSB_D10: U3.47(FD[10])
HUSB_D11: U3.48(FD[11])
HUSB_D12: U3.49(FD[12])
HUSB_D13: U3.50(FD[13])
HUSB_D14: U3.51(FD[14])
HUSB_D15: U3.52(FD[15])
HUSB_VBUS: R2.1 R3.1 ; port INT.VBUS
IFCLK: R6.1 ; port INT.IFCLK
RD_N: U3.1(SLRD) ; port INT.RD_N
RESET_N: U1000.3(~{MR}) ; port INT.RESET_N
USB_RST: R1000.1 U3.42(~{RESET}) U1000.2(~{RESET})
VBUS: R2.2 R4.1 ; port EXT.VBUS
WR_N: U3.2(SLWR) ; port INT.WR_N
XTALIN: U3.5(XTALIN) ; port INT.XTALIN
XTALOUT: U3.4(XTALOUT) ; port INT.XTALOUT
NetR4_2: R4.2 U2.5(VP)
NetR6_2: R6.2 U3.13(IFCLK)
NetR7_1: R7.1 U3.34(~{INT}) ; port INT.INT_N
NetR8_2: R8.2 U3.16(SDA)
NetR9_2: R9.2 U3.15(SCL)
NetU3_29: U3.29(FLAGA) ; port INT.FLAGA
NetU3_30: U3.30(FLAGB) ; port INT.FLAGB
NetU3_31: U3.31(FLAGC) ; port INT.FLAGC
NetU3_33: U3.33(READY) ; port INT.READY
NetU3_35: U3.35(SLOE) ; port INT.SLOE
NetU3_36: U3.36(FIFOADR2) ; port INT.FIFOADR2
NetU3_37: U3.37(FIFOADR0) ; port INT.FIFOADR0
NetU3_38: U3.38(FIFOADR1) ; port INT.FIFOADR1
NetU3_39: U3.39(PKTEND) ; port INT.PKTEND
NetU3_40: U3.40(FLAGD/~{CS}) ; port INT.FLAGD_CS_N

Not connected (* = marked no-connect by the designer): U2 3(NC)* 4(NC)*; U3 54(NC)*

### Channels
DBUSB_TXRX: designators end in A
DBUSB_TXRX: designators end in B

### Buses and harness runs
bus HUSB_D[15..0]

### Notes on the sheet
- PCB footprint to implement thermal pad. See CY7C68001 data sheet for details.
- (near R6) Place R3_US close to U1 end.
- (near U1000) Reset Threshold: 2.63v
- (near U1000) Reset Duration: 1.5ms
- Sheet Title
- Project Title
- Size:
- Date:
- A4
- Assy:
- Time:
- Revision:
- Sheet
- of
- File:

### Library data of the parts
C2-C5 C8 C9 = D-101-0080: as C5_FP on sheet FPGA_Bypass_1V2; Category: Capacitor; Capacitance: 0.1 uF; Dielectric: X7R; Mounting Technology: Surface Mount; Rated Voltage: 16 V; Status: Production; Technology: Ceramic; Tolerance: 10 %
C6 C7 = D-101-0007: as C1_FP on sheet FPGA_Bypass_1V2; Category: Capacitor; Capacitance: 10 uF; Mounting Technology: Surface Mount; Rated Voltage: 20 V; Status: Production; Technology: Tantalum; Tolerance: 10 %
NT1 = D-002-0003: Net-Tie, Surface Mount, 2 x 1.6mm x 0.8mm SMT Pads - For 0.8mm Track; Category: Net-Tie; Status: Production
R2 = D-100-0105: Resistor, 2K7 1% 0402 (1005); Power Rating: 63 mW; Resistance: 2.7 K; Category: Resistor; Mounting Technology: Surface Mount; Status: Production; Tolerance: 1 %
R3 = D-100-0086: Resistor, 5K6 1% 0402 (1005); Power Rating: 63 mW; Resistance: 5.6 K; Category: Resistor; Mounting Technology: Surface Mount; Status: Production; Tolerance: 1 %
R4 = D-100-0130: Resistor, 10K 1% 0402 (1005); Power Rating: 63 mW; Category: Resistor; Mounting Technology: Surface Mount; Resistance: 10 K; Status: Production; Tolerance: 1 %
R6 = D-100-0108: Resistor, 27R 1% 0402 (1005); Power Rating: 63 mW; Category: Resistor; Mounting Technology: Surface Mount; Resistance: 27 R; Status: Production; Tolerance: 1 %
R7-R9 R1000 = D-100-0088: as R1#4 on sheet HOST_FPGA_NonIO; Category: Resistor; Mounting Technology: Surface Mount; Status: Production; Tolerance: 1 %
U2 = D-204-0001: NUP2201MR6, Low Capacitance Diode Array, USB Protection; Max Input Voltage: mV; Max Output Current: mA; Category: IC-Power; Max Output Voltage: mV; Min Input Voltage: mV; Min Output Voltage: mV; Mounting Technology: Surface Mount; Status: Production; Supply Voltage: mV
U3 = D-221-0004: CY7C68001-56LFC, EZ-USB SX2 High-Speed USB Interface; Comm Standard: None; Category: IC-Communication; Mounting Technology: Surface Mount; Status: Production
U1000 = D-243-0000: MAX6315, Open-Drain Output SOT Reset IC, Customized Reset Thresholds, Timeout Delays; Category: IC-Other; Status: Production